# EasyEDA Pro project MN42_v2a.eprj, board MOAR_Board
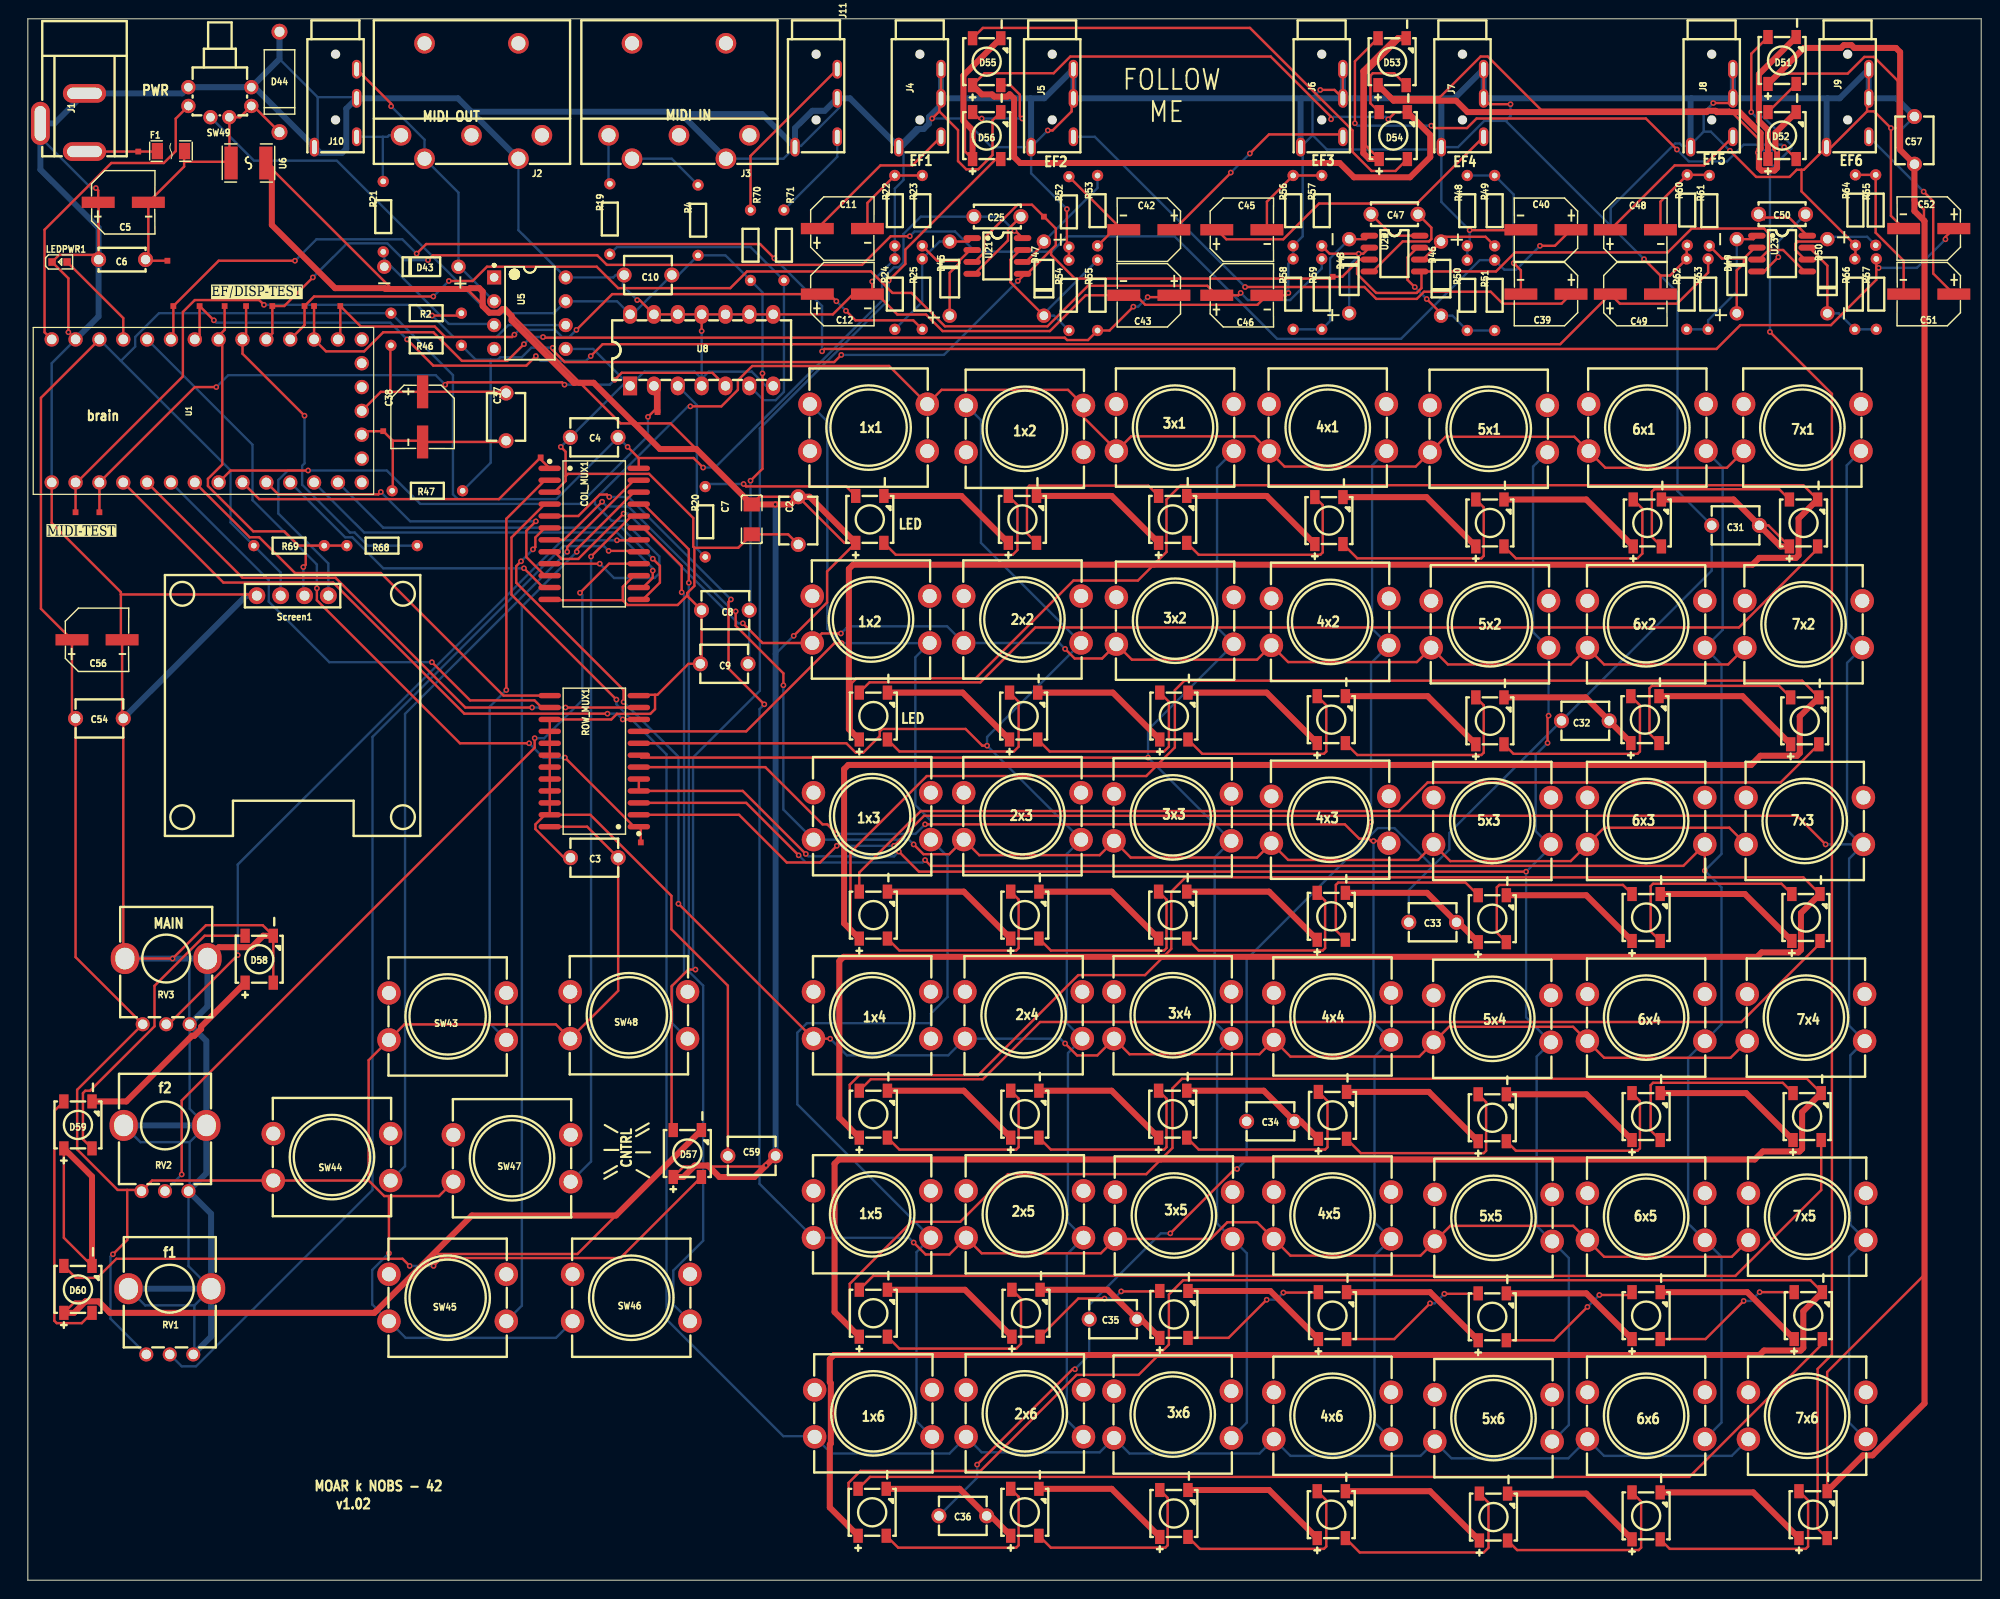
[diagram p3: board, top side]
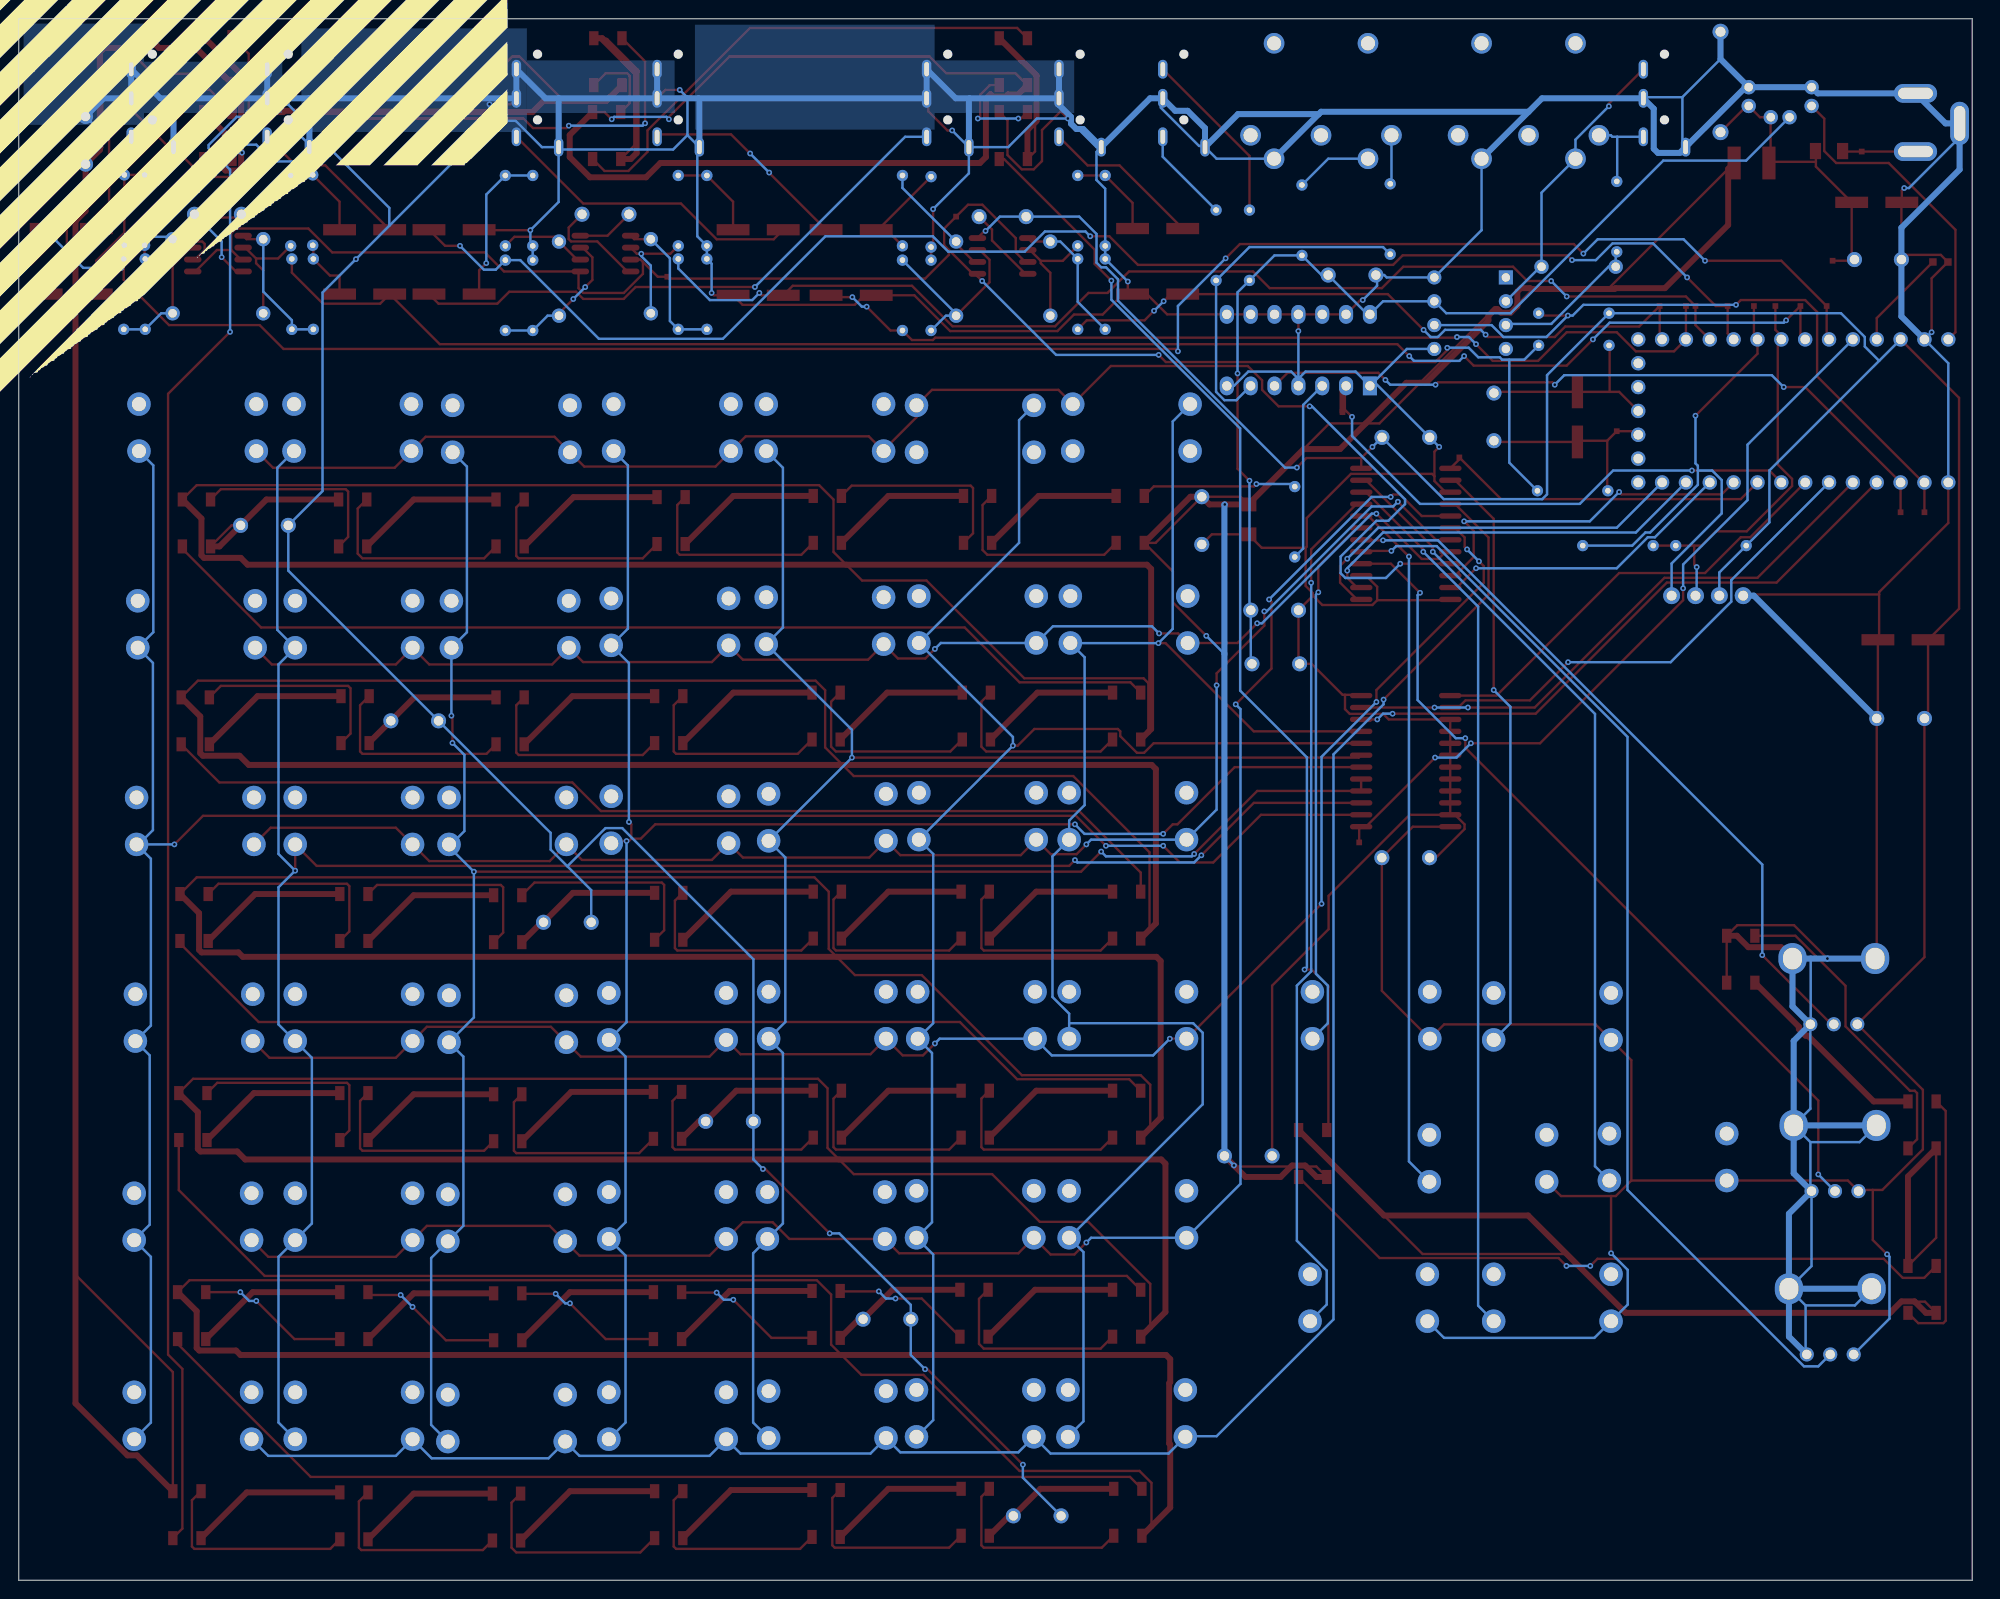
[diagram p4: board, bottom side, seen from below]

Outline 208.03 x 166.37 mm; copper layers: Top Layer, Bottom Layer. Coordinates in mm from the lower left corner of the outline.
Outline path: 0,166.37 0,0 208.03,0 208.03,166.37 0,166.37
Stack: Top Layer 0.035mm / Dielectric1 1.51mm FR4 er 4.5 / Bottom Layer 0.035mm

## Design rules (mm)
template: User Custom Config
spacing safeClearance (default): track to track 0.152, other pairs 0.152 to 0.3
track width trackWidth (default): min 0.127, default 0.254, max 2.54
differential pair differentialPair (default): width min 0.127, default 0.254, max 2.54; gap min 0.152, default 0.152
via viaSize (default): diameter min 0.5, default 0.61, max 10; hole min 0.3, default 0.305, max 5.999

## Placement (name value [footprint] x y rotation side)
C2  100nF  [CAP-TH_L5.0-W4.0-P5.00-D1.0]  82.04 112.9 270 top
C3  100nF  [CAP-TH_L5.0-W4.0-P5.00-D1.0]  60.33 76.98 0 top
C4  100nF  [CAP-TH_L5.0-W4.0-P5.00-D1.0]  60.31 121.77 0 top
C5  220uF  [CAP-SMD_BD6.3-L6.6-W6.6-FD]  10.16 146.81 0 top
C6  100nF  [CAP-TH_L5.0-W2.5-P5.00-D1.0]  10.03 140.72 0 top
C7  100uF  [C1206]  77.09 113.03 90 top
C8  1uF  [CAP-TH_L5.0-W4.0-P5.00-D1.0]  74.28 103.36 180 top
C9  100nF  [CAP-TH_L5.0-W4.0-P5.00-D1.0]  74.16 97.64 180 top
C10  100nF  [CAP-TH_L5.0-W4.0-P5.00-D1.0]  66.04 139.06 0 top
C11  1uF  [CAP-SMD_BD6.3-L6.6-W6.6-FD]  86.74 144.02 0 top
C12  1uF  [CAP-SMD_BD6.3-L6.6-W6.6-FD]  86.74 137.03 0 top
C25  100nF  [CAP-TH_L5.0-W2.5-P5.00-D1.0]  103.25 145.29 180 top
C31  100nF  [CAP-TH_L5.0-W4.0-P5.00-D1.0]  181.86 112.4 180 top
C32  100nF  [CAP-TH_L5.0-W4.0-P5.00-D1.0]  165.86 91.57 180 top
C33  100nF  [CAP-TH_L5.0-W4.0-P5.00-D1.0]  149.61 70.1 180 top
C34  100nF  [CAP-TH_L5.0-W4.0-P5.00-D1.0]  132.33 48.9 180 top
C35  100nF  [CAP-TH_L5.0-W4.0-P5.00-D1.0]  115.57 27.81 180 top
C36  100nF  [CAP-TH_L5.0-W4.0-P5.00-D1.0]  99.57 6.86 180 top
C37  100nF  [CAP-TH_L5.0-W4.0-P5.00-D1.0]  50.93 123.95 270 top
C38  4.7uF  [CAP-SMD_BD6.3-L6.6-W6.6-FD]  42.04 123.95 270 top
C39  1uF  [CAP-SMD_BD6.3-L6.6-W6.6-FD]  161.67 137.03 180 top
C40  1uF  [CAP-SMD_BD6.3-L6.6-W6.6-FD]  161.67 143.89 180 top
C42  1uF  [CAP-SMD_BD6.3-L6.6-W6.6-FD]  119.38 143.89 180 top
C43  1uF  [CAP-SMD_BD6.3-L6.6-W6.6-FD]  119.38 136.91 180 top
C45  1uF  [CAP-SMD_BD6.3-L6.6-W6.6-FD]  129.29 143.89 0 top
C46  1uF  [CAP-SMD_BD6.3-L6.6-W6.6-FD]  129.29 136.91 0 top
C47  100nF  [CAP-TH_L5.0-W2.5-P5.00-D1.0]  145.54 145.54 180 top
C48  1uF  [CAP-SMD_BD6.3-L6.6-W6.6-FD]  171.2 143.89 0 top
C49  1uF  [CAP-SMD_BD6.3-L6.6-W6.6-FD]  171.2 137.03 0 top
C50  100nF  [CAP-TH_L5.0-W2.5-P5.00-D1.0]  186.82 145.54 180 top
C51  1uF  [CAP-SMD_BD6.3-L6.6-W6.6-FD]  202.44 137.03 180 top
C52  1uF  [CAP-SMD_BD6.3-L6.6-W6.6-FD]  202.44 144.02 180 top
C54  1uF  [CAP-TH_L5.0-W4.0-P5.00-D1.0]  7.62 91.82 0 top
C56  10uF  [CAP-SMD_BD6.3-L6.6-W6.6-FD]  7.37 100.2 0 top
C57  100nF  [CAP-TH_L5.0-W4.0-P5.00-D1.0]  200.91 153.42 90 top
C59  100nF  [CAP-TH_L5.0-W4.0-P5.00-D1.0]  77.09 45.21 180 top
COL_MUX1  CD74HC4067M96  [SOIC-24_L15.4-W7.5-P1.27-LS10.3-BL]  60.31 111.48 270 top
D1  XL-5050RGBC-WS2812B  [LED-SMD_4P-L5.0-W5.0-BL_XL-5050RGBC]  89.66 113.03 0 top
D2  XL-5050RGBC-WS2812B  [LED-SMD_4P-L5.0-W5.0-BL_XL-5050RGBC]  105.92 113.03 0 top
D3  XL-5050RGBC-WS2812B  [LED-SMD_4P-L5.0-W5.0-BL_XL-5050RGBC]  121.92 113.03 0 top
D4  XL-5050RGBC-WS2812B  [LED-SMD_4P-L5.0-W5.0-BL_XL-5050RGBC]  138.56 112.9 0 top
D5  XL-5050RGBC-WS2812B  [LED-SMD_4P-L5.0-W5.0-BL_XL-5050RGBC]  155.7 112.65 0 top
D6  XL-5050RGBC-WS2812B  [LED-SMD_4P-L5.0-W5.0-BL_XL-5050RGBC]  172.47 112.65 0 top
D7  XL-5050RGBC-WS2812B  [LED-SMD_4P-L5.0-W5.0-BL_XL-5050RGBC]  189.1 112.65 0 top
D8  XL-5050RGBC-WS2812B  [LED-SMD_4P-L5.0-W5.0-BL_XL-5050RGBC]  90.04 92.08 0 top
D9  XL-5050RGBC-WS2812B  [LED-SMD_4P-L5.0-W5.0-BL_XL-5050RGBC]  106.05 92.08 0 top
D10  XL-5050RGBC-WS2812B  [LED-SMD_4P-L5.0-W5.0-BL_XL-5050RGBC]  122.05 92.08 0 top
D11  XL-5050RGBC-WS2812B  [LED-SMD_4P-L5.0-W5.0-BL_XL-5050RGBC]  138.81 91.69 0 top
D12  XL-5050RGBC-WS2812B  [LED-SMD_4P-L5.0-W5.0-BL_XL-5050RGBC]  155.7 91.57 0 top
D13  XL-5050RGBC-WS2812B  [LED-SMD_4P-L5.0-W5.0-BL_XL-5050RGBC]  172.21 91.69 0 top
D14  XL-5050RGBC-WS2812B  [LED-SMD_4P-L5.0-W5.0-BL_XL-5050RGBC]  189.23 91.57 0 top
D15  XL-5050RGBC-WS2812B  [LED-SMD_4P-L5.0-W5.0-BL_XL-5050RGBC]  90.04 70.87 0 top
D16  XL-5050RGBC-WS2812B  [LED-SMD_4P-L5.0-W5.0-BL_XL-5050RGBC]  106.17 70.87 0 top
D17  XL-5050RGBC-WS2812B  [LED-SMD_4P-L5.0-W5.0-BL_XL-5050RGBC]  121.92 70.87 0 top
D18  XL-5050RGBC-WS2812B  [LED-SMD_4P-L5.0-W5.0-BL_XL-5050RGBC]  138.81 70.74 0 top
D19  XL-5050RGBC-WS2812B  [LED-SMD_4P-L5.0-W5.0-BL_XL-5050RGBC]  155.96 70.49 0 top
D20  XL-5050RGBC-WS2812B  [LED-SMD_4P-L5.0-W5.0-BL_XL-5050RGBC]  172.34 70.61 0 top
D21  XL-5050RGBC-WS2812B  [LED-SMD_4P-L5.0-W5.0-BL_XL-5050RGBC]  189.36 70.61 0 top
D22  XL-5050RGBC-WS2812B  [LED-SMD_4P-L5.0-W5.0-BL_XL-5050RGBC]  90.04 49.66 0 top
D23  XL-5050RGBC-WS2812B  [LED-SMD_4P-L5.0-W5.0-BL_XL-5050RGBC]  106.17 49.66 0 top
D24  XL-5050RGBC-WS2812B  [LED-SMD_4P-L5.0-W5.0-BL_XL-5050RGBC]  121.92 49.66 0 top
D25  XL-5050RGBC-WS2812B  [LED-SMD_4P-L5.0-W5.0-BL_XL-5050RGBC]  138.94 49.53 0 top
D26  XL-5050RGBC-WS2812B  [LED-SMD_4P-L5.0-W5.0-BL_XL-5050RGBC]  155.96 49.28 0 top
D27  XL-5050RGBC-WS2812B  [LED-SMD_4P-L5.0-W5.0-BL_XL-5050RGBC]  172.34 49.4 0 top
D28  XL-5050RGBC-WS2812B  [LED-SMD_4P-L5.0-W5.0-BL_XL-5050RGBC]  189.48 49.4 0 top
D29  XL-5050RGBC-WS2812B  [LED-SMD_4P-L5.0-W5.0-BL_XL-5050RGBC]  90.04 28.45 0 top
D30  XL-5050RGBC-WS2812B  [LED-SMD_4P-L5.0-W5.0-BL_XL-5050RGBC]  106.3 28.45 0 top
D31  XL-5050RGBC-WS2812B  [LED-SMD_4P-L5.0-W5.0-BL_XL-5050RGBC]  122.05 28.32 0 top
D32  XL-5050RGBC-WS2812B  [LED-SMD_4P-L5.0-W5.0-BL_XL-5050RGBC]  138.94 28.19 0 top
D33  XL-5050RGBC-WS2812B  [LED-SMD_4P-L5.0-W5.0-BL_XL-5050RGBC]  155.96 28.07 0 top
D34  XL-5050RGBC-WS2812B  [LED-SMD_4P-L5.0-W5.0-BL_XL-5050RGBC]  172.34 28.19 0 top
D35  XL-5050RGBC-WS2812B  [LED-SMD_4P-L5.0-W5.0-BL_XL-5050RGBC]  189.61 28.19 0 top
D36  XL-5050RGBC-WS2812B  [LED-SMD_4P-L5.0-W5.0-BL_XL-5050RGBC]  89.92 7.24 0 top
D37  XL-5050RGBC-WS2812B  [LED-SMD_4P-L5.0-W5.0-BL_XL-5050RGBC]  106.17 7.24 0 top
D38  XL-5050RGBC-WS2812B  [LED-SMD_4P-L5.0-W5.0-BL_XL-5050RGBC]  122.05 7.11 0 top
D39  XL-5050RGBC-WS2812B  [LED-SMD_4P-L5.0-W5.0-BL_XL-5050RGBC]  138.81 6.99 0 top
D40  XL-5050RGBC-WS2812B  [LED-SMD_4P-L5.0-W5.0-BL_XL-5050RGBC]  156.08 6.73 0 top
D41  XL-5050RGBC-WS2812B  [LED-SMD_4P-L5.0-W5.0-BL_XL-5050RGBC]  172.34 6.86 0 top
D42  XL-5050RGBC-WS2812B  [LED-SMD_4P-L5.0-W5.0-BL_XL-5050RGBC]  190.12 6.99 0 top
D43  1N4148PF  [DO-35_BD1.9-L3.9-P7.90-D0.5-FD]  41.91 139.95 180 top
D44  SA6.0A  [DO-15_BD3.1-L6.7-P10.70-D0.8-RD]  26.8 159.64 90 top
D45  1N4148PF  [DO-35_BD1.9-L3.9-P7.90-D0.5-FD]  98.17 138.68 90 top
D46  1N4148PF  [DO-35_BD1.9-L3.9-P7.90-D0.5-FD]  150.5 138.68 270 top
D47  1N4148PF  [DO-35_BD1.9-L3.9-P7.90-D0.5-FD]  108.2 138.68 270 top
D48  1N4148PF  [DO-35_BD1.9-L3.9-P7.90-D0.5-FD]  140.72 138.94 90 top
D49  1N4148PF  [DO-35_BD1.9-L3.9-P7.90-D0.5-FD]  181.99 138.94 90 top
D50  1N4148PF  [DO-35_BD1.9-L3.9-P7.90-D0.5-FD]  191.64 138.94 270 top
D51  XL-5050RGBC-WS2812B  [LED-SMD_4P-L5.0-W5.0-BL_XL-5050RGBC]  186.82 161.93 0 top
D52  XL-5050RGBC-WS2812B  [LED-SMD_4P-L5.0-W5.0-BL_XL-5050RGBC]  186.82 153.92 0 top
D53  XL-5050RGBC-WS2812B  [LED-SMD_4P-L5.0-W5.0-BL_XL-5050RGBC]  145.29 161.8 0 top
D54  XL-5050RGBC-WS2812B  [LED-SMD_4P-L5.0-W5.0-BL_XL-5050RGBC]  145.42 153.92 0 top
D55  XL-5050RGBC-WS2812B  [LED-SMD_4P-L5.0-W5.0-BL_XL-5050RGBC]  102.11 161.8 0 top
D56  XL-5050RGBC-WS2812B  [LED-SMD_4P-L5.0-W5.0-BL_XL-5050RGBC]  102.11 153.92 0 top
D57  XL-5050RGBC-WS2812B  [LED-SMD_4P-L5.0-W5.0-BL_XL-5050RGBC]  70.23 45.47 0 top
D58  XL-5050RGBC-WS2812B  [LED-SMD_4P-L5.0-W5.0-BL_XL-5050RGBC]  24.64 66.17 0 top
D59  XL-5050RGBC-WS2812B  [LED-SMD_4P-L5.0-W5.0-BL_XL-5050RGBC]  5.33 48.51 0 top
D60  XL-5050RGBC-WS2812B  [LED-SMD_4P-L5.0-W5.0-BL_XL-5050RGBC]  5.33 30.99 0 top
F1  nSMD050-33V  [F1206]  15.24 152.27 0 top
J1  DC005  [DC-IN-TH_DC005]  3.68 155.32 270 top
J2  DIN-504B-M10  [CONN-TH_DIN-504B-M10]  47.24 157.61 180 top
J3  DIN-504B-M10  [CONN-TH_DIN-504B-M10]  69.34 157.61 180 top
J4  HC-PJ-320A  [AUDIO-SMD_HC-PJ-320A]  95 156.84 270 top
J5  HC-PJ-320A  [AUDIO-SMD_HC-PJ-320A]  109.09 156.84 270 top
J6  HC-PJ-320A  [AUDIO-SMD_HC-PJ-320A]  137.8 156.84 270 top
J7  HC-PJ-320A  [AUDIO-SMD_HC-PJ-320A]  152.78 156.84 270 top
J8  HC-PJ-320A  [AUDIO-SMD_HC-PJ-320A]  179.32 156.84 270 top
J9  HC-PJ-320A  [AUDIO-SMD_HC-PJ-320A]  193.8 156.84 270 top
J10  HC-PJ-320A  [AUDIO-SMD_HC-PJ-320A]  32.77 156.84 270 top
J11  HC-PJ-320A  [AUDIO-SMD_HC-PJ-320A]  83.95 156.84 270 top
LEDPWR1  -  [LED_0603]  3.43 140.46 0 top
NOREF  -  [Pad_e234]  54.61 119.63 0 top
NOREF#2  -  [Pad_e6035]  20.95 135.76 0 top
NOREF#3  -  [Pad_e6023]  33.27 135.76 0 top
NOREF#4  -  [Pad_e6020]  26.03 135.76 0 top
NOREF#5  -  [Pad_e236]  65.28 78.61 0 top
NOREF#6  -  [Pad_e6029]  15.49 135.76 0 top
NOREF#7  -  [Pad_e213]  14.86 140.59 0 top
NOREF#8  -  [Pad_e6036]  23.24 135.76 0 top
NOREF#9  -  [Pad_e6019]  18.29 135.76 0 top
NOREF#10  -  [Pad_e146]  11.76 152.22 0 top
NOREF#11  -  [Pad_e215]  37.85 122.43 0 top
NOREF#12  -  [Pad_e6017]  67.06 124.46 0 top
NOREF#13  -  [Pad_e223]  138.96 138.88 0 top
NOREF#14  -  [Pad_e222]  108.2 145.29 0 top
NOREF#15  -  [Pad_e6022]  30.48 135.76 0 top
NOREF#16  -  [Pad_e229]  184.7 145.19 0 top
NOREF#17  -  [Pad_e6015]  7.62 113.79 0 top
NOREF#18  -  [Pad_e6013]  5.08 113.79 0 top
NOREF#19  -  [Pad_e6021]  29.46 135.76 0 top
R2  4.7kΩ  [RES-TH_BD1.7-L3.5-P7.50-D0.5]  42.42 135 0 top
R4  220Ω  [RES-TH_BD1.7-L3.5-P7.50-D0.5]  71.37 144.91 270 top
R19  220Ω  [RES-TH_BD1.7-L3.5-P7.50-D0.5]  61.98 145.03 270 top
R20  33Ω  [RES-TH_BD1.7-L3.5-P7.50-D0.5]  72.14 112.78 90 top
R21  220Ω  [RES-TH_BD1.7-L3.5-P7.50-D0.5]  37.85 145.29 90 top
R22  100kΩ  [RES-TH_BD1.7-L3.5-P7.50-D0.5]  92.33 145.92 90 top
R23  10kΩ  [RES-TH_BD1.7-L3.5-P7.50-D0.5]  95.25 145.92 90 top
R24  20kΩ  [RES-TH_BD1.7-L3.5-P7.50-D0.5]  92.33 137.03 90 top
R25  4.7kΩ  [RES-TH_BD1.7-L3.5-P7.50-D0.5]  95.25 137.03 270 top
R46  100kΩ  [RES-TH_BD1.7-L3.5-P7.50-D0.5]  42.42 131.57 0 top
R47  100kΩ  [RES-TH_BD1.7-L3.5-P7.50-D0.5]  42.55 116.08 0 top
R48  100kΩ  [RES-TH_BD1.7-L3.5-P7.50-D0.5]  153.29 145.92 90 top
R49  10kΩ  [RES-TH_BD1.7-L3.5-P7.50-D0.5]  156.21 145.92 90 top
R50  20kΩ  [RES-TH_BD1.7-L3.5-P7.50-D0.5]  153.29 136.91 90 top
R51  4.7kΩ  [RES-TH_BD1.7-L3.5-P7.50-D0.5]  156.21 136.91 90 top
R52  100kΩ  [RES-TH_BD1.7-L3.5-P7.50-D0.5]  110.87 145.8 90 top
R53  10kΩ  [RES-TH_BD1.7-L3.5-P7.50-D0.5]  113.92 145.92 270 top
R54  20kΩ  [RES-TH_BD1.7-L3.5-P7.50-D0.5]  110.87 136.91 90 top
R55  4.7kΩ  [RES-TH_BD1.7-L3.5-P7.50-D0.5]  113.92 136.91 270 top
R56  100kΩ  [RES-TH_BD1.7-L3.5-P7.50-D0.5]  134.75 145.92 90 top
R57  10kΩ  [RES-TH_BD1.7-L3.5-P7.50-D0.5]  137.8 145.92 90 top
R58  20kΩ  [RES-TH_BD1.7-L3.5-P7.50-D0.5]  134.75 137.03 90 top
R59  4.7kΩ  [RES-TH_BD1.7-L3.5-P7.50-D0.5]  137.8 137.03 90 top
R60  100kΩ  [RES-TH_BD1.7-L3.5-P7.50-D0.5]  176.72 145.99 90 top
R61  10kΩ  [RES-TH_BD1.7-L3.5-P7.50-D0.5]  179.07 145.92 90 top
R62  20kΩ  [RES-TH_BD1.7-L3.5-P7.50-D0.5]  176.66 137.03 90 top
R63  4.7kΩ  [RES-TH_BD1.7-L3.5-P7.50-D0.5]  178.94 137.03 90 top
R64  100kΩ  [RES-TH_BD1.7-L3.5-P7.50-D0.5]  194.63 145.99 90 top
R65  10kΩ  [RES-TH_BD1.7-L3.5-P7.50-D0.5]  196.79 145.99 90 top
R66  20kΩ  [RES-TH_BD1.7-L3.5-P7.50-D0.5]  194.56 137.03 90 top
R67  4.7kΩ  [RES-TH_BD1.7-L3.5-P7.50-D0.5]  196.85 137.03 90 top
R68  4.7kΩ  [RES-TH_BD1.7-L3.5-P7.50-D0.5]  37.72 110.24 0 top
R69  4.7kΩ  [RES-TH_BD1.7-L3.5-P7.50-D0.5]  27.81 110.24 0 top
R70  220Ω  [RES-TH_BD1.7-L3.5-P7.50-D0.5]  76.96 142.24 270 top
R71  220Ω  [RES-TH_BD1.7-L3.5-P7.50-D0.5]  80.52 142.24 270 top
ROW_MUX1  CD74HC4067M96  [SOIC-24_L15.4-W7.5-P1.27-LS10.3-BL]  60.33 87.27 90 top
RV1  10kΩ  [RES-ADJ-TH_RK09K1130A5R]  15.11 27.56 0 top
RV2  10kΩ  [RES-ADJ-TH_RK09K1130A5R]  14.61 44.96 0 top
RV3  10kΩ  [RES-ADJ-TH_RK09K1130A5R]  14.73 62.74 0 top
Screen1  HS96L03W2C03  [OLED-TH_L27.8-W27.2-P2.54_C9900033791]  28.19 104.9 0 top
SW1  HX B3F-4055-Y  [SW-TH_4P-L12.0-W12.0-P5.00-LS12.5]  89.54 122.81 0 top
SW2  HX B3F-4055-Y  [SW-TH_4P-L12.0-W12.0-P5.00-LS12.5]  106.17 122.68 0 top
SW3  HX B3F-4055-Y  [SW-TH_4P-L12.0-W12.0-P5.00-LS12.5]  122.17 122.81 180 top
SW4  HX B3F-4055-Y  [SW-TH_4P-L12.0-W12.0-P5.00-LS12.5]  138.43 122.81 180 top
SW5  HX B3F-4055-Y  [SW-TH_4P-L12.0-W12.0-P5.00-LS12.5]  155.57 122.68 180 top
SW6  HX B3F-4055-Y  [SW-TH_4P-L12.0-W12.0-P5.00-LS12.5]  172.47 122.81 180 top
SW7  HX B3F-4055-Y  [SW-TH_4P-L12.0-W12.0-P5.00-LS12.5]  188.98 122.81 180 top
SW8  HX B3F-4055-Y  [SW-TH_4P-L12.0-W12.0-P5.00-LS12.5]  89.79 102.36 180 top
SW9  HX B3F-4055-Y  [SW-TH_4P-L12.0-W12.0-P5.00-LS12.5]  105.92 102.36 180 top
SW10  HX B3F-4055-Y  [SW-TH_4P-L12.0-W12.0-P5.00-LS12.5]  122.17 102.24 180 top
SW11  HX B3F-4055-Y  [SW-TH_4P-L12.0-W12.0-P5.00-LS12.5]  138.68 102.11 180 top
SW12  HX B3F-4055-Y  [SW-TH_4P-L12.0-W12.0-P5.00-LS12.5]  155.7 101.85 180 top
SW13  HX B3F-4055-Y  [SW-TH_4P-L12.0-W12.0-P5.00-LS12.5]  172.34 101.85 180 top
SW14  HX B3F-4055-Y  [SW-TH_4P-L12.0-W12.0-P5.00-LS12.5]  189.1 101.85 180 top
SW15  HX B3F-4055-Y  [SW-TH_4P-L12.0-W12.0-P5.00-LS12.5]  89.92 81.41 180 top
SW16  HX B3F-4055-Y  [SW-TH_4P-L12.0-W12.0-P5.00-LS12.5]  105.92 81.41 180 top
SW17  HX B3F-4055-Y  [SW-TH_4P-L12.0-W12.0-P5.00-LS12.5]  121.92 81.28 180 top
SW18  HX B3F-4055-Y  [SW-TH_4P-L12.0-W12.0-P5.00-LS12.5]  138.68 81.03 180 top
SW19  HX B3F-4055-Y  [SW-TH_4P-L12.0-W12.0-P5.00-LS12.5]  155.96 80.9 180 top
SW20  HX B3F-4055-Y  [SW-TH_4P-L12.0-W12.0-P5.00-LS12.5]  172.34 80.9 180 top
SW21  HX B3F-4055-Y  [SW-TH_4P-L12.0-W12.0-P5.00-LS12.5]  189.23 80.9 180 top
SW22  HX B3F-4055-Y  [SW-TH_4P-L12.0-W12.0-P5.00-LS12.5]  89.92 60.2 180 top
SW23  HX B3F-4055-Y  [SW-TH_4P-L12.0-W12.0-P5.00-LS12.5]  106.05 60.2 180 top
SW24  HX B3F-4055-Y  [SW-TH_4P-L12.0-W12.0-P5.00-LS12.5]  121.92 60.2 180 top
SW25  HX B3F-4055-Y  [SW-TH_4P-L12.0-W12.0-P5.00-LS12.5]  138.94 60.07 180 top
SW26  HX B3F-4055-Y  [SW-TH_4P-L12.0-W12.0-P5.00-LS12.5]  155.96 59.82 180 top
SW27  HX B3F-4055-Y  [SW-TH_4P-L12.0-W12.0-P5.00-LS12.5]  172.34 59.94 180 top
SW28  HX B3F-4055-Y  [SW-TH_4P-L12.0-W12.0-P5.00-LS12.5]  189.36 59.94 180 top
SW29  HX B3F-4055-Y  [SW-TH_4P-L12.0-W12.0-P5.00-LS12.5]  89.92 38.99 180 top
SW30  HX B3F-4055-Y  [SW-TH_4P-L12.0-W12.0-P5.00-LS12.5]  106.17 38.99 180 top
SW31  HX B3F-4055-Y  [SW-TH_4P-L12.0-W12.0-P5.00-LS12.5]  122.05 38.86 180 top
SW32  HX B3F-4055-Y  [SW-TH_4P-L12.0-W12.0-P5.00-LS12.5]  138.94 38.86 180 top
SW33  HX B3F-4055-Y  [SW-TH_4P-L12.0-W12.0-P5.00-LS12.5]  156.08 38.61 180 top
SW34  HX B3F-4055-Y  [SW-TH_4P-L12.0-W12.0-P5.00-LS12.5]  172.34 38.74 180 top
SW35  HX B3F-4055-Y  [SW-TH_4P-L12.0-W12.0-P5.00-LS12.5]  189.48 38.74 180 top
SW36  HX B3F-4055-Y  [SW-TH_4P-L12.0-W12.0-P5.00-LS12.5]  90.04 17.78 180 top
SW37  HX B3F-4055-Y  [SW-TH_4P-L12.0-W12.0-P5.00-LS12.5]  106.17 17.78 180 top
SW38  HX B3F-4055-Y  [SW-TH_4P-L12.0-W12.0-P5.00-LS12.5]  121.92 17.65 180 top
SW39  HX B3F-4055-Y  [SW-TH_4P-L12.0-W12.0-P5.00-LS12.5]  138.94 17.53 180 top
SW40  HX B3F-4055-Y  [SW-TH_4P-L12.0-W12.0-P5.00-LS12.5]  156.08 17.27 180 top
SW41  HX B3F-4055-Y  [SW-TH_4P-L12.0-W12.0-P5.00-LS12.5]  172.34 17.53 180 top
SW42  HX B3F-4055-Y  [SW-TH_4P-L12.0-W12.0-P5.00-LS12.5]  189.48 17.53 180 top
SW43  HX B3F-4055-Y  [SW-TH_4P-L12.0-W12.0-P5.00-LS12.5]  44.7 60.07 180 top
SW44  HX B3F-4055-Y  [SW-TH_4P-L12.0-W12.0-P5.00-LS12.5]  32.39 45.09 180 top
SW45  HX B3F-4055-Y  [SW-TH_4P-L12.0-W12.0-P5.00-LS12.5]  44.7 30.1 180 top
SW46  HX B3F-4055-Y  [SW-TH_4P-L12.0-W12.0-P5.00-LS12.5]  64.26 30.1 180 top
SW47  HX B3F-4055-Y  [SW-TH_4P-L12.0-W12.0-P5.00-LS12.5]  51.56 44.96 180 top
SW48  HX B3F-4055-Y  [SW-TH_4P-L12.0-W12.0-P5.00-LS12.5]  64.01 60.2 180 top
SW49  TK-6580A-1  [SW-TH_TK-6580A-1]  20.45 157.48 180 top
U1  Teensy  [teensy 4.0:MODULE_DEV-15583]  19.05 124.59 90 top
U5  6N138  [DIP-8_L9.8-W6.6-P2.54-LS7.6-BL]  53.47 135 270 top
U6  1812L200/33GR  [F1812]  23.5 151 0 top
U8  SN74AHCT125N  [PDIP-14_L19.3-W6.4-P2.54-LS7.6-BL]  71.75 131.06 0 top
U21  MCP6002DRG  [SOP-8_L4.9-W3.9-P1.27-LS6.0-BL]  103.25 141.1 270 top
U22  MCP6002DRG  [SOP-8_L4.9-W3.9-P1.27-LS6.0-BL]  145.54 141.35 270 top
U23  MCP6002DRG  [SOP-8_L4.9-W3.9-P1.27-LS6.0-BL]  186.82 141.35 270 top

## Footprints (pads in the part's own frame, mm; a bottom-side part is the same pattern mirrored in y, then rotated)
AUDIO-SMD_HC-PJ-320A
  oval 2x1 hole 1.5x0.5: 1(4.15,-2.25) 2(-4.15,2.25) 3(-1.05,2.25) 4(3.05,2.25)
C1206
  rect 1.485x1.728 smd: 1(-1.593,0) 2(1.593,0)
CAP-SMD_BD6.3-L6.6-W6.6-FD
  rect 3.5x1.2 smd: 1(-2.67,0) 2(2.67,0)
CAP-TH_L5.0-W2.5-P5.00-D1.0
  round 1.6 hole 1: 1(-2.5,0) 2(2.5,0)
CAP-TH_L5.0-W4.0-P5.00-D1.0
  round 1.6 hole 1: 1(-2.54,0) 2(2.54,0)
CONN-TH_DIN-504B-M10
  round 2.2 hole 1.5: 1(-7.5,3.65) 2(-5,6.15) 3(0,3.65) 4(5,6.15) 5(7.5,3.65) 6(-5,-6.15) 7(5,-6.15)
DC-IN-TH_DC005
  oval 2x4.6 hole 1.2x3.7: 1(3.1,2.35) 2(-3.1,2.35)
  oval 4.6x2 hole 3.7x1.2: 3(0.1,-2.35)
DIP-8_L9.8-W6.6-P2.54-LS7.6-BL
  rect 1.5x1.5 hole 0.9: 1(-3.81,-3.81)
  round 1.5 hole 0.9: 2(-1.27,-3.81) 3(1.27,-3.81) 4(3.81,-3.81) 5(3.81,3.81) 6(1.27,3.81) 7(-1.27,3.81) 8(-3.81,3.81)
DO-15_BD3.1-L6.7-P10.70-D0.8-RD
  round 1.7 hole 1.06: 1(-5.35,0) 2(5.35,0)
DO-35_BD1.9-L3.9-P7.90-D0.5-FD
  round 1.524 hole 0.914: 1(-3.95,0) 2(3.95,0)
F1206
  rect 1.19x1.728 smd: 1(-1.445,0) 2(1.445,0)
F1812
  rect 1.407x3.499 smd: 1(-1.853,0) 2(1.853,0)
LED-SMD_4P-L5.0-W5.0-BL_XL-5050RGBC
  rect 1x1.5 smd: 1(-1.5,-2.5) 2(1.5,-2.5) 3(1.5,2.5) 4(-1.5,2.5)
LED_0603
  rect 0.8x0.8 smd: 1(-0.851,-0.01) 2(0.75,-0.005)
OLED-TH_L27.8-W27.2-P2.54_C9900033791
  round 1.8 hole 1.05: 1(-3.81,0) 2(-1.27,0) 3(1.27,0) 4(3.81,0)
Pad_e146
  rect 0.61x0.61 smd: TP2(0,0)
Pad_e213
  rect 0.61x0.61 smd: TP3(0,0)
Pad_e215
  rect 0.61x0.61 smd: TP4(0,0)
Pad_e222
  rect 0.61x0.61 smd: TP5(0,0)
Pad_e223
  rect 0.61x0.61 smd: TP6(0,0)
Pad_e229
  rect 0.61x0.61 smd: TP7(0,0)
Pad_e234
  rect 0.61x0.61 smd: TP8(0,0)
Pad_e236
  rect 0.61x0.61 smd: TP9(0,0)
Pad_e6013
  rect 0.61x0.61 smd: TP10(0,0)
Pad_e6015
  rect 0.61x0.61 smd: TP11(0,0)
Pad_e6017
  rect 0.61x0.61 smd: TP12(0,0)
Pad_e6019
  rect 0.61x0.61 smd: TP13(0,0)
Pad_e6020
  rect 0.61x0.61 smd: TP14(0,0)
Pad_e6021
  rect 0.61x0.61 smd: TP15(0,0)
Pad_e6022
  rect 0.61x0.61 smd: TP16(0,0)
Pad_e6023
  rect 0.61x0.61 smd: TP17(0,0)
Pad_e6029
  rect 0.61x0.61 smd: TP18(0,0)
Pad_e6035
  rect 0.61x0.61 smd: TP19(0,0)
Pad_e6036
  rect 0.61x0.61 smd: TP20(0,0)
PDIP-14_L19.3-W6.4-P2.54-LS7.6-BL
  rect 1.5x2 hole 1: 1(-7.62,-3.81)
  oval 1.5x2 hole 1: 2(-5.08,-3.81) 3(-2.54,-3.81) 4(0,-3.81) 5(2.54,-3.81) 6(5.08,-3.81) 7(7.62,-3.81) 8(7.62,3.81) 9(5.08,3.81) 10(2.54,3.81) 11(0,3.81) 12(-2.54,3.81) 13(-5.08,3.81) 14(-7.62,3.81)
RES-ADJ-TH_RK09K1130A5R
  round 1.5 hole 1: 1(-2.5,-3.5) 2(0,-3.5) 3(2.5,-3.5)
  oval 3x3.3 hole 2x2.3: 4(4.4,3.5) 5(-4.4,3.5)
RES-TH_BD1.7-L3.5-P7.50-D0.5
  round 1.2 hole 0.6: 1(-3.75,0) 2(3.75,0)
SOIC-24_L15.4-W7.5-P1.27-LS10.3-BL
  oval 0.574x2.388 smd: 1(-6.985,-4.744) 2(-5.715,-4.744) 3(-4.445,-4.744) 4(-3.175,-4.744) 5(-1.905,-4.744) 6(-0.635,-4.744) 7(0.635,-4.744) 8(1.905,-4.744) 9(3.175,-4.744) 10(4.445,-4.744) 11(5.715,-4.744) 12(6.985,-4.744) 13(6.985,4.744) 14(5.715,4.744) 15(4.445,4.744) 16(3.175,4.744) 17(1.905,4.744) 18(0.635,4.744) 19(-0.635,4.744) 20(-1.905,4.744) 21(-3.175,4.744) 22(-4.445,4.744) 23(-5.715,4.744) 24(-6.985,4.744)
SOP-8_L4.9-W3.9-P1.27-LS6.0-BL
  oval 0.63x1.865 smd: 1(-1.905,-2.683) 2(-0.635,-2.683) 3(0.635,-2.683) 4(1.905,-2.683) 5(1.905,2.683) 6(0.635,2.683) 7(-0.635,2.683) 8(-1.905,2.683)
SW-TH_4P-L12.0-W12.0-P5.00-LS12.5
  round 2.5 hole 1.5: 1(-6.25,2.5) 2(6.25,2.5) 3(-6.25,-2.5) 4(6.25,-2.5)
SW-TH_TK-6580A-1
  round 1.524 hole 0.914: 1(3.35,-1.6) 2(3.35,0.4) 3(-3.35,-1.6) 4(-3.35,0.4) 5(1,1.6) 6(-1,1.6)
teensy 4.0:MODULE_DEV-15583
  round 1.53 hole 1.02: 0(-7.62,13.97) 1(-7.62,11.43) 2(-7.62,8.89) 3(-7.62,6.35) 3.3V_1(-2.54,-16.51) 3.3V_2(7.62,11.43) 4(-7.62,3.81) 5(-7.62,1.27) 6(-7.62,-1.27) 7(-7.62,-3.81) 8(-7.62,-6.35) 9(-7.62,-8.89) 10(-7.62,-11.43) 11(-7.62,-13.97) 12(-7.62,-16.51) 13(7.62,-16.51) 14(7.62,-13.97) 15(7.62,-11.43) 16(7.62,-8.89) 17(7.62,-6.35) 18(7.62,-3.81) 19(7.62,-1.27) 20(7.62,1.27) 21(7.62,3.81) 22(7.62,6.35) 23(7.62,8.89) G1(-7.62,16.51) G2(0,-16.51) G3(7.62,13.97) ON-OFF(5.08,-16.51) PGM(2.54,-16.51) VBAT(-5.08,-16.51) VIN(7.62,16.51)

## Nets
As in the schematic, except:
VIN_FUSED: C5.2 C6.2 D44.1 F1.2 NOREF#7.TP3 SW49.4 SW49.6 U6.1
VIN_RAW: F1.1 J1.1 NOREF#10.TP2
E1: C12.1 NOREF#3.TP17 R25.2 U1.14
E2: C43.1 NOREF#15.TP16 R55.2 U1.15
E3: C46.1 NOREF#19.TP15 R59.2 U1.16
E4: C40.1 NOREF#4.TP14 R51.2 U1.17
E5: C49.1 NOREF#9.TP13 R63.2 U1.20
E6: C52.1 NOREF#6.TP18 R67.2 U1.21
LED: NOREF#12.TP12 U1.6 U8.2
MIDI_RX: NOREF#18.TP10 R2.2 U1.0 U5.6
MIDI_TX: NOREF#17.TP11 U1.1 U8.5
MRC: COL_MUX1.1 NOREF.TP8 U1.7
MRR: NOREF#5.TP9 ROW_MUX1.1 U1.22
SCL: NOREF#2.TP19 R68.1 R69.2 Screen1.3 U1.19
SDA: NOREF#8.TP20 R68.2 Screen1.4 U1.18
VREF: NOREF#13.TP6 NOREF#14.TP5 R46.2 R47.2 U21.3 U21.5 U22.3 U22.5 U23.3 U23.5
$1N66700: C37.2 C38.2 NOREF#11.TP4 R47.1 U1.3.3V_1
$2N10057: C50.2 NOREF#16.TP7 U23.8

Pads without a net: J2 1 3 6 7; J3 1 3 6 7; SW1 3 4; SW2 3 4; SW3 3 4; SW4 3 4; SW5 3 4; SW6 3 4; SW7 3 4; SW8 3 4; SW9 3 4; SW10 3 4; SW11 3 4; SW12 3 4; SW13 3 4; SW14 3 4; SW15 3 4; SW16 3 4; SW17 3 4; SW18 3 4; SW19 3 4; SW20 3 4; SW21 3 4; SW22 3 4; SW23 3 4; SW24 3 4; SW25 3 4; SW26 3 4; SW27 3 4; SW28 3 4; SW29 3 4; SW30 3 4; SW31 3 4; SW32 3 4; SW33 3 4; SW34 3 4; SW35 3 4; SW36 3 4; SW37 3 4; SW38 3 4; SW39 3 4; SW40 3 4; SW41 3 4; SW42 3 4; SW43 3 4; SW44 3 4; SW45 3 4; SW46 3 4; SW47 3 4; SW48 3 4; U1 12 13 ON-OFF PGM VBAT; U5 1 4

## Via types
v1: diameter 0.61, hole 0.305, Top Layer to Bottom Layer, 171 vias

## Routing (per net, layer and track width the routed paths; a pad name or vN(x,y) marks a point on that pad's centre or on a via; arc(x,y) is an arc through that point)
3VDC: length 432.2
  Top Layer w0.254: U1.3.3V_2 1.39,125.98 1.39,103.51 C56.1 4.7,92.21 C54.1 5.08,66.39 RV3.1 5.25,52.25 5.25,45.9 9.57,41.59 10.58,41.59 ; 65.06,119.57 70.9,119.57 v1(71.92,118.55) ; 65.06,119.57 v1(63.87,120.76) ; 65.06,119.57 COL_MUX1.24 ; 36.3,42.59 37.95,40.93 38.45,40.93 ; 36.3,42.59 SW44.2 13.23,42.59 RV2.1 11.98,41.59 10.58,41.59 ; 36.3,42.59 36.3,55.41 SW43.2 40.11,59.22 56.23,59.22 SW48.2 62.87,62.81 C3.2 59.56,80.29 ROW_MUX1.24 ; 10.58,41.59 10.58,36.25 v1(9.06,34.73) ; 38.45,40.93 v1(38.45,34.84) ; 38.45,40.93 43.79,40.93 SW47.2 ; U21.8 105.17,143.76 v1(105.07,143.76)
  Bottom Layer w0.254: v1(71.92,118.55) 73.19,118.55 90.96,136.33 90.96,138.62 92.23,139.89 92.74,139.89 93.25,140.4 93.25,143.44 95.1,145.29 C25.2 103.55,145.29 v1(105.07,143.76) ; v1(9.06,34.73) 8.8,34.47 8.8,27.87 RV1.1 ; Screen1.2 26.92,107.38 R69.1 21.59,112.71 21.59,118.24 9.91,129.92 ; SW46.2 56.23,25.82 40.23,25.82 SW45.2 36.68,29.38 36.68,33.06 v1(38.45,34.84) ; 9.91,129.92 U1.3.3V_2 ; 9.91,129.92 11.43,131.44 11.43,132.46 13.97,135 R2.1 45.27,128.4 45.27,115.7 45.78,115.19 56.27,115.19 C4.2 v1(63.87,120.76)
5VDC: length 113
  Top Layer w0.254: v1(78.23,128.58) 78.23,118.42 v1(76.96,117.15)
  Bottom Layer w0.254: SW49.5 24.07,151.26 32.89,151.26 49.15,135 56.01,135 U5.7 62.74,136.27 U8.14 64.39,134.87 C10.2 69.28,139.06 R4.2 74.3,141.16 R70.2 78.23,137.22 v1(78.23,128.58) ; C9.1 76.82,97.77 C8.1 76.96,103.5 v1(76.96,117.15)
GND: length 1399.7
  Top Layer w0.254: 89.92,137.54 v1(89.92,138.37) ; 89.92,137.54 92.6,134.86 95.65,134.86 97.41,133.1 108.84,133.1 112.65,136.91 C43.2 117.98,136.91 119,135.89 130.94,135.89 C46.2 133.99,136.91 v1(134.24,137.16) ; 89.92,137.54 C12.2 89.28,136.91 87.76,136.91 85.73,134.87 U8.8 U8.9 U8.10 U8.11 ; COL_MUX1.3 56.08,115.93 57.27,117.12 57.27,117.63 ; J8.2 J8.3 181.07,157.39 v1(179.49,157.39) ; 63.36,104.42 63.87,103.91 69.2,103.91 70.22,104.93 ; 63.36,104.42 63.36,105.85 64.55,107.04 COL_MUX1.15 ; 63.36,104.42 55.65,104.42 COL_MUX1.12 ; U8.11 v1(71.75,133.1) ; U8.11 U8.12 U8.13 65.15,136.4 v1(64.9,136.4) ; 70.22,104.93 70.22,104.88 C8.2 71.74,97.77 C9.2 70.35,97.64 67.04,94.34 66.79,94.34 ; 70.22,104.93 70.22,105.18 70.98,105.94 70.98,110.01 ; v1(153.54,143.84) 158.95,143.84 C40.2 ; 195.87,156.5 196.63,156.5 v1(198.41,154.73) 198.41,145.38 C52.2 ; 195.87,156.5 195.87,157.71 J9.3 J9.2 ; 195.87,156.5 192.06,152.69 J9.1 189.14,150.28 188.88,150.28 ; 9.91,105.03 9.91,105.28 2.54,112.65 U1.G1 ; 9.91,105.03 24.26,105.03 Screen1.1 ; 9.91,105.03 9.91,100.33 C56.2 10.04,91.95 C54.2 10.16,66.41 RV3.5 v1(15.41,66.24) 18.97,69.79 25.01,69.79 D58.3 D58.2 ; v1(108.62,154.47) 109.13,154.47 111.16,156.5 111.16,157.71 J5.3 J5.2 ; v1(181.26,152.31) 184.06,149.52 187.62,149.52 188.38,150.28 188.88,150.28 ; 70.98,110.01 70.86,110.12 70.86,113.17 66.16,117.88 57.52,117.88 57.27,117.63 ; 70.98,110.01 75.66,110.01 C7.1 80.97,111.44 C2.2 ; 57.27,117.63 57.27,120.25 v1(56.76,120.76) ; ROW_MUX1.23 ROW_MUX1.22 ROW_MUX1.21 ROW_MUX1.20 ROW_MUX1.19 ROW_MUX1.18 ROW_MUX1.17 ROW_MUX1.16 ROW_MUX1.15 62.13,91.72 62.73,92.31 66.28,92.31 66.79,92.82 66.79,94.34 ; ROW_MUX1.23 55.07,81.56 54.06,80.54 54.06,80.03 57.11,76.98 C3.1 ; ROW_MUX1.23 59.9,81.56 68.53,72.92 68.53,69.36 74.55,63.35 74.55,45.21 ; J7.2 J7.3 155.66,157.27 v1(157.9,157.27) ; J6.2 J6.3 139.15,158.79 v1(137.64,158.79) ; v1(101.09,12.32) 111.25,22.48 v1(111.51,22.48) ; 188.88,150.28 188.88,147.98 R64.1 194.63,140.85 R66.2 ; R60.1 176.66,142.17 R62.2 174.89,139.01 173.87,139.01 ; v1(121.67,36.96) 128.52,43.81 v1(128.78,43.81) ; 173.87,139.01 C49.2 ; 173.87,139.01 v1(172.12,140.76) ; v1(96.3,155.74) 97.06,156.5 ; 97.06,156.5 97.06,157.71 J4.3 J4.2 ; 97.06,156.5 99.06,154.51 99.06,151.21 99.94,150.33 101.21,150.33 102.73,151.85 102.73,155.55 D56.3 ; ROW_MUX1.12 65.15,94.34 66.79,94.34 ; v1(7.24,148.34) 7.49,148.08 C5.1 7.53,146.77 C6.1 7.04,141.21 3.34,141.21 LEDPWR1.1 4.32,138.71 v1(4.32,132.97) ; v1(110.65,146.09) 110.65,142.26 R52.1 R54.2
  Top Layer w0.635: RV3.4 20.34,67.45 23.83,67.45 25.05,68.67 D58.3
  Bottom Layer w0.254: 71.75,128.02 70.99,128.78 65.66,128.78 U8.1 63.63,127.76 ; 71.75,128.02 v1(71.75,133.1) ; 71.75,128.02 72.52,128.78 77.09,128.78 78.61,127.25 U8.7 ; 71.75,128.02 U8.4 ; v1(181.26,152.31) 179.23,154.35 178.47,154.35 ; v1(56.76,120.76) C4.1 63.63,127.63 63.63,127.76 ; 63.63,127.76 60.2,131.19 U5.5 ; v1(198.41,154.73) 199.69,154.73 C57.2 ; 136.81,153.97 136.81,157.97 v1(137.64,158.79) ; 136.81,153.97 138.34,152.44 150.28,152.44 J7.1 ; 136.81,153.97 J6.1 135.76,152.48 135.76,143.19 R56.1 R58.2 134.24,140.28 v1(134.24,137.16) ; v1(121.67,36.96) 120.65,36.96 113.03,29.34 C35.2 113.03,24 v1(111.51,22.48) ; 17.23,46.68 RV2.4 17.23,50.23 RV3.3 ; 17.23,46.68 11.98,46.68 RV2.5 ; 17.23,46.68 17.23,41.58 ; 149.61,76.07 151.38,77.85 151.38,79.63 C32.2 179.32,107.57 C31.2 175.68,116.04 175.68,137.2 v1(172.12,140.76) 168.56,144.31 ; 149.61,76.07 145.54,80.14 143.76,80.14 129.79,66.17 C34.2 129.79,44.83 v1(128.78,43.81) ; 149.61,76.07 147.07,73.53 C33.2 ; 63.37,139.06 62.61,139.06 62.36,138.81 U5.8 52.24,143.84 J2.2 ; 63.37,139.06 C10.1 ; 63.37,139.06 63.37,137.92 v1(64.9,136.4) ; 168.56,144.31 168.56,146.22 175.42,153.08 175.93,153.08 176.19,152.82 176.95,152.82 ; 168.56,144.31 157.39,155.49 ; C36.2 101.09,10.92 v1(101.09,12.32) ; J11.3 86.4,157.78 86.4,156.89 82.33,152.82 81.82,152.82 80.46,151.46 J3.2 ; U1.G1 2.54,129.67 U1.G3 v1(4.32,132.97) ; 176.95,152.82 178.47,154.35 ; 176.95,152.82 J8.1 ; 17.19,66.24 17.19,59.28 ; v1(7.24,148.34) 6.73,148.34 1.33,153.73 ; 95.97,155.41 v1(96.3,155.74) 99.6,155.74 102.65,152.69 J5.1 ; J5.1 v1(108.62,154.47) ; J5.1 106.84,149.9 v1(110.65,146.09) ; 178.47,154.35 178.47,156.38 v1(179.49,157.39) ; 17.73,29.28 12.49,29.28 RV1.5 ; 17.73,29.28 17.73,24.18 ; 17.73,29.28 19.51,31.06 17.11,33.47 RV2.3 ; 26.8,162.08 30.86,158.02 ; 30.86,158.02 30.86,153.04 J10.1 ; 30.86,158.02 34.89,158.02 J10.3 ; J7.1 152.31,152.69 155.1,155.49 157.39,155.49 ; J7.1 150.53,146.85 v1(153.54,143.84) 153.54,142.43 R48.1 R50.2 ; v1(89.92,138.37) R24.2 R22.1 92.33,148.27 93.25,149.19 93.25,152.19 J4.1 93.25,152.69 95.18,154.62 ; 157.39,155.49 157.9,156 v1(157.9,157.27)
  Bottom Layer w0.635: 69.59,156.21 78.18,156.21 81.7,152.69 81.7,154.72 83.55,156.56 84.87,156.56 J11.3 87.55,157.9 J4.1 94.68,154.62 95.4,154.62 95.97,155.19 95.97,155.92 97.25,157.19 J4.3 ; 69.59,156.21 69.34,156.46 47.24,156.46 ; 69.59,156.21 J3.2 ; Screen1.1 23.24,104.9 C54.2 ; J6.3 150.54,157.9 ; J6.3 J6.2 ; J6.3 135.65,157.9 ; 150.54,157.9 150.53,157.88 J7.1 ; 150.54,157.9 151.93,157.9 J7.2 J7.3 177.13,157.9 ; 135.65,157.9 J5.3 J5.2 108.24,157.9 106.79,157.9 ; 135.65,157.9 135.55,157.79 J6.1 ; RV2.4 19.01,57.47 RV3.3 19.13,61.14 RV3.4 v1(15.41,66.24) RV3.5 ; RV2.4 19.01,43.36 RV2.3 19.51,39.05 19.51,31.06 ; RV2.4 RV2.5 ; 106.79,157.9 106.84,157.84 J5.1 ; 106.79,157.9 J4.3 ; J8.3 J8.2 ; J8.3 177.13,157.9 ; J8.3 191.61,157.9 ; SW49.3 SW49.1 16.44,158.42 J1.2 2.83,155.22 1.33,155.22 1.33,150.31 7.53,144.11 C6.1 7.53,134.66 U1.G3 ; SW49.3 26.8,162.08 D44.2 ; SW49.3 24.13,159.08 J10.1 31.13,152.08 33.46,152.08 33.91,152.53 33.91,156.79 J10.3 45.81,157.9 47.24,156.46 ; 19.51,31.06 19.51,25.96 RV1.3 ; 19.51,31.06 RV1.5 ; 47.24,156.46 J2.2 ; J9.1 191.55,157.84 191.61,157.9 ; 191.61,157.9 192.95,157.9 J9.2 J9.3 198.98,157.9 C57.2 ; J4.3 J4.2 ; 177.13,157.9 177.07,157.84 J8.1
VIN_FUSED: length 32.5
  Top Layer w0.254: D44.1 24.01,157.08 SW49.4 22.6,155.88 SW49.6 21.47,155.86 21.47,151.13 ; 16.64,151.13 16.64,152.23 F1.2 ; 16.64,151.13 21.47,151.13 ; 16.64,151.13 16.64,150.62 C5.2 ; 21.47,151.13 U6.1 ; C6.2 12.66,140.59 12.83,140.59 ; 12.83,140.59 NOREF#7.TP3 ; 12.83,140.59 12.83,146.81
VIN_RAW: length 7.8
  Top Layer w0.254: F1.1 13.74,152.22 NOREF#10.TP2 J1.1
CNTRL_LED: length 167.6
  Top Layer w0.254: D51.4 183.54,162.65 v1(183.54,156.43) ; D42.2 190.6,5.5 190.6,22.52 192.13,24.04 192.13,126.41 v1(185.52,133.01)
  Bottom Layer w0.254: v1(185.52,133.01) 185.52,150.28 187.81,152.57 187.81,152.92 184.81,155.92 184.05,155.92 v1(183.54,156.43)
CNTRLLP: length 227.2
  Top Layer w0.254: 201.93,32.5 191.62,22.19 D42.3 ; 199.39,152.4 199.14,152.65 199.14,159.77 196.6,162.31 195.58,162.31 193.8,160.53 186.42,160.53 ; 200.91,147.05 201.93,146.03 201.93,144.87
  Top Layer w0.635: D42.3 195.44,13.31 196.45,13.31 201.99,18.85 201.99,144.81 200.91,145.89 C57.1 199.39,152.4 199.39,162.81 198.94,163.26 194.51,163.26 194.2,163.56 193.4,163.56 193.1,163.26 189.16,163.26 D51.1
COL1: length 164
  Top Layer w0.254: 115.98,120.36 112.42,123.91 SW2.2 110.77,126.83 97.31,126.83 SW1.2 91.72,129.37 77.14,129.37 75.62,127.85 75.62,126.83 73.86,125.07 v1(70.56,125.07) ; 115.98,120.36 117.5,121.88 130.61,121.88 SW4.2 133.83,118.66 147.8,118.66 SW5.2 150.98,121.83 164.69,121.83 SW6.2 167.99,118.53 180.95,118.53 SW7.2 ; 115.98,120.36 SW3.2 ; COL_MUX1.9 v1(60.9,108.31)
  Bottom Layer w0.254: v1(70.56,125.07) 70.3,125.07 60.39,115.17 60.39,114.66 62.17,112.88 63.44,112.88 67.25,109.07 67.25,107.29 66.75,106.79 62.43,106.79 v1(60.9,108.31)
COL2: length 143.7
  Top Layer w0.254: SW14.2 181.07,97.58 167.87,97.58 SW13.2 164.31,97.58 151.23,97.58 SW12.2 147.93,97.83 134.21,97.83 SW11.2 130.91,98.08 117.58,98.08 SW10.2 114.4,98.21 111.48,98.21 v1(110.46,99.23) ; v1(76.14,101.96) 78.24,99.86 SW8.2 84.55,100.88 v1(86.59,100.88) ; COL_MUX1.8 56.08,109.58 56.84,108.82 58.62,108.82 v1(63.44,113.64)
  Bottom Layer w0.254: v1(110.46,99.23) 109.83,99.86 SW9.2 97.89,101.64 87.35,101.64 v1(86.59,100.88) ; v1(63.44,113.64) 63.95,113.64 75.64,101.96 v1(76.14,101.96)
COL3: length 161.7
  Top Layer w0.254: v1(94.33,78.4) 95.38,77.36 98.12,77.36 SW16.2 101.32,77.26 114.15,77.26 SW17.2 117.45,77 130.91,77 SW18.2 134.21,76.75 148.06,76.75 SW19.2 151.48,76.62 164.31,76.62 SW20.2 167.87,80.18 181.2,80.18 SW21.2 ; v1(75.38,103.23) 75.38,101.71 80.46,96.63 v1(80.46,95.36) ; v1(61.16,114.91) 57.09,110.85 COL_MUX1.7
  Bottom Layer w0.254: v1(80.46,95.36) 80.46,82.11 SW15.2 93.83,78.91 v1(94.33,78.4) ; v1(75.38,103.23) 75.13,103.23 63.95,114.41 61.67,114.41 v1(61.16,114.91)
COL4: length 177.2
  Top Layer w0.254: v1(110.46,57.19) 111.73,55.92 113.89,55.92 SW24.2 117.32,56.05 131.16,56.05 SW25.2 134.47,55.79 148.18,55.79 SW26.2 151.36,58.97 164.56,58.97 SW27.2 167.87,55.67 181.33,55.67 SW28.2 ; v1(69.28,72.08) SW22.2 v1(85.44,57.7) ; v1(52.52,108.56) 52.01,108.06 52.01,106.28 63.44,94.85 v1(63.44,93.58) ; v1(53.79,109.83) 54.05,110.09 54.05,111.1 55.06,112.12 COL_MUX1.6
  Bottom Layer w0.254: v1(110.46,57.19) 109.95,57.7 SW23.2 98.02,55.92 87.22,55.92 v1(85.44,57.7) ; v1(53.79,109.83) v1(52.52,108.56) ; v1(63.44,93.58) 69.28,87.74 v1(69.28,72.08)
COL5: length 205.1
  Top Layer w0.254: v1(94.33,35.98) 95.6,34.71 98.14,34.71 SW30.2 101.57,34.84 114.27,34.84 SW31.2 125.96,36.36 127.73,38.14 130.91,38.14 SW32.2 134.47,34.58 148.31,34.58 SW33.2 151.48,37.76 164.56,37.76 SW34.2 167.87,34.46 181.46,34.46 SW35.2 ; v1(61.92,115.42) 61.67,115.68 60.9,115.68 58.62,113.39 COL_MUX1.5 ; v1(74.87,104.5) 74.62,104.25 74.62,97.13 v1(78.43,93.32)
  Bottom Layer w0.254: v1(78.43,93.32) 77.92,92.82 77.92,42.23 SW29.2 93.83,36.49 v1(94.33,35.98) ; v1(61.92,115.42) 63.95,115.42 v1(74.87,104.5)
COL6: length 224.6
  Top Layer w0.254: COL_MUX1.4 55.06,114.66 51.5,111.1 51.5,105.01 v1(62.68,93.83)
  Bottom Layer w0.254: SW42.2 181.46,13.25 167.87,13.25 SW41.2 164.06,12.99 151.61,12.99 SW40.2 148.31,13.25 134.47,13.25 SW39.2 131.16,13.5 117.32,13.5 SW38.2 114.15,13.63 101.57,13.63 SW37.2 98.14,13.5 85.57,13.5 SW36.2 83.73,15.35 80.46,15.35 68.02,27.79 68.02,87.99 62.68,93.32 v1(62.68,93.83)
CTRL1: length 63.3
  Top Layer w0.254: v1(50.95,94.85) 50.95,113.09 55.06,117.2 COL_MUX1.2
  Bottom Layer w0.254: v1(50.95,94.85) 49.18,93.07 49.18,59.35 SW43.1
CTRL2: length 85.9
  Top Layer w0.254: v1(57.44,109.58) 57.44,110.09 64.55,117.2 COL_MUX1.23
  Bottom Layer w0.254: SW44.1 40.17,44.12 40.17,92.31 v1(57.44,109.58)
CTRL3: length 94.5
  Top Layer w0.254: v1(58.45,109.58) 58.45,109.83 64.55,115.93 COL_MUX1.22
  Bottom Layer w0.254: SW45.1 52.61,29.26 52.61,103.74 v1(58.45,109.58)
CTRL4: length 92.3
  Top Layer w0.254: COL_MUX1.21 65.56,114.66 70.39,109.83 v1(70.39,106.28)
  Bottom Layer w0.254: v1(70.39,106.28) 70.39,64.88 71.92,63.35 71.92,36.17 68.73,32.99 68.73,29.38 SW46.1
CTRL5: length 74.4
  Top Layer w0.254: v1(59.98,109.07) 64.3,113.39 COL_MUX1.20
  Bottom Layer w0.254: v1(59.98,109.07) 59.98,44.62 SW47.1
CTRL6: length 57.9
  Top Layer w0.254: COL_MUX1.19 65.56,112.12 69.63,108.06 v1(69.63,105.26)
  Bottom Layer w0.254: SW48.1 68.61,59.34 68.61,63.35 69.88,64.62 69.88,105.01 v1(69.63,105.26)
E1: length 71.1
  Top Layer w0.254: v1(58.42,133.22) 62.23,137.03 C12.1 85.34,137.03 v1(86.1,136.27) ; v1(87.12,135.25) 88.14,134.24 94.29,134.24 R25.2 ; v1(51.82,132.72) 51.56,132.46 44.45,132.46 43.33,133.58 35.46,133.58 NOREF#3.TP17 33.27,132.46 U1.14
  Bottom Layer w0.254: v1(58.42,133.22) 57.66,132.46 56.9,132.46 56.13,133.22 52.32,133.22 v1(51.82,132.72) ; v1(86.1,136.27) v1(87.12,135.25)
E2: length 100.9
  Top Layer w0.254: v1(117.73,135.7) 115.19,133.16 R55.2 112.9,132.14 110.68,132.14 110.42,132.39 54.93,132.39 v1(54.86,132.46) ; v1(119.25,136.71) 121.86,136.71 C43.1 ; NOREF#15.TP16 U1.15 31.75,130.94 35.81,130.94 37.85,132.97 43.18,132.97 46.23,129.92 51.05,129.92 v1(52.83,131.7)
  Bottom Layer w0.254: v1(52.83,131.7) 53.59,132.46 v1(54.86,132.46) ; v1(119.25,136.71) 118.24,135.7 v1(117.73,135.7)
E3: length 123.4
  Top Layer w0.254: v1(43.18,136.78) 30.48,136.78 NOREF#19.TP15 29.46,133.73 U1.16 ; v1(129.16,137.16) 128.9,136.91 C46.1 125.6,137.92 112.9,137.92 108.58,133.6 97.66,133.6 94.11,137.16 92.08,137.16 89.79,139.45 76.58,139.45 74.8,137.67 62.87,137.67 60.58,139.95 48.89,139.95 47.37,138.43 v1(44.83,138.43)
  Bottom Layer w0.254: R59.2 137.8,139.77 134.43,136.4 129.92,136.4 v1(129.16,137.16) ; v1(43.18,136.78) v1(44.83,138.43)
E4: length 159.5
  Top Layer w0.254: v1(93.92,143.2) 91.89,143.2 88.84,140.15 61.66,140.15 60.65,141.16 43.12,141.16 v1(42.61,140.66) ; v1(30.35,138.81) 27.31,135.76 NOREF#4.TP14 26.03,132.84 U1.17 ; C40.1 162.63,142.18 v1(161.04,142.18)
  Bottom Layer w0.254: v1(30.35,138.81) 33.98,142.43 38.29,142.43 40.07,140.66 v1(42.61,140.66) ; v1(161.04,142.18) 158.5,139.64 157.23,139.64 R51.2 154.63,140.66 146.24,132.27 133.04,132.27 122.11,143.2 110.68,143.2 109.04,141.55 100.9,141.55 98.75,143.7 94.43,143.7 v1(93.92,143.2)
E5: length 173.9
  Top Layer w0.254: v1(54.1,130.43) 53.09,129.41 43.18,129.41 v1(40.39,132.21) ; R63.2 178.94,139.32 175.64,136.02 169.54,136.02 C49.1 163.19,131.7 61.21,131.7 v1(59.94,130.43) ; v1(19.81,134.24) NOREF#9.TP13 18.29,132.72 U1.20
  Bottom Layer w0.254: v1(40.39,132.21) 38.61,133.99 20.07,133.99 v1(19.81,134.24) ; v1(59.94,130.43) 59.44,129.92 54.61,129.92 v1(54.1,130.43)
E6: length 212.1
  Top Layer w0.254: v1(28.45,140.59) 20.32,140.59 NOREF#6.TP18 15.49,132.46 U1.21 ; v1(79.5,140.84) 77.98,142.37 42.42,142.37 v1(41.4,141.35) ; v1(84.58,130.94) 84.84,131.19 179.83,131.19 182.37,133.73 192.02,133.73 196.85,138.56 196.85,139.83 ; 196.85,139.83 R67.2 ; 196.85,139.83 v1(197.1,139.83) ; C52.1 204.22,143.13 v1(204.22,142.88)
  Bottom Layer w0.254: v1(41.4,141.35) 39.88,142.88 30.73,142.88 v1(28.45,140.59) ; v1(84.58,130.94) 84.58,135.76 v1(79.5,140.84) ; v1(204.22,142.88) 201.17,139.83 v1(197.1,139.83)
FP1: length 115.2
  Top Layer w0.254: v1(61.85,109.67) 64.96,109.67 COL_MUX1.17
  Bottom Layer w0.254: RV1.2 16.38,22.79 17.91,22.79 36.7,41.59 36.7,89.86 57.02,110.18 61.34,110.18 v1(61.85,109.67)
FP2: length 90.4
  Top Layer w0.254: v1(58.8,105.21) 61.9,108.31 COL_MUX1.16 ; v1(53.98,89.72) 53.98,88.7 16.38,51.11 v1(16.38,43.24)
  Bottom Layer w0.254: v1(58.8,105.21) 59.06,104.96 59.06,93.78 54.99,89.72 v1(53.98,89.72) ; RV2.2 v1(16.38,43.24)
LED: length 59.6
  Top Layer w0.254: v1(29.84,118.24) 21.59,118.24 U1.6 ; NOREF#12.TP12 66.8,124.71 ; 66.8,124.71 66.8,127.13 ; 66.8,124.71 v1(66.04,123.95)
  Top Layer w0.635: U8.2 67.06,126.87 NOREF#12.TP12
  Bottom Layer w0.254: v1(29.84,118.24) 38.23,118.24 41.78,114.68 58.8,114.68 66.04,121.92 v1(66.04,123.95)
LEDCNTRL: length 16.7
  Top Layer w0.254: v1(76.22,116.8) 76.48,116.55 87.15,116.55 D1.4
  Bottom Layer w0.254: R20.2 72.41,116.8 v1(76.22,116.8)
MAIN: length 77.4
  Top Layer w0.254: COL_MUX1.18 65.01,110.8 v1(62.74,110.8) ; v1(22.35,66.6) 14.99,59.24 RV3.2
  Bottom Layer w0.254: v1(62.74,110.8) 56.9,110.8 22.35,76.26 v1(22.35,66.6)
MIDI_OUT: length 36.9
  Bottom Layer w0.254: U8.6 78.36,125.73 79.63,125.73 80.52,126.62 R71.2 76.96,142.05 62.74,142.05 R19.2
MIDI_RX: length 72.9
  Top Layer w0.254: R2.2 45.91,134.75 v1(43.05,134.75) ; 5.08,116.84 U1.0 ; 5.08,116.84 16.51,128.27 16.51,135.13 17.78,136.4 24.64,136.4 v1(25.15,135.89) ; 5.08,116.84 NOREF#18.TP10
  Bottom Layer w0.254: v1(25.15,135.89) 41.4,135.89 42.55,134.75 v1(43.05,134.75) 45.34,132.46 49.91,132.46 51.18,133.73 U5.6
MIDI_TX: length 76.3
  Top Layer w0.254: NOREF#17.TP11 U1.1 17.78,127.13 v1(20.07,127.13) ; v1(57.15,127.38) 56.9,127.64 44.7,127.64 v1(44.45,127.38) ; v1(62.48,127.89) 63.25,128.65 72.9,128.65 U8.5
  Bottom Layer w0.254: v1(57.15,127.38) 61.98,127.38 v1(62.48,127.89) ; v1(44.45,127.38) 43.43,128.4 21.34,128.4 v1(20.07,127.13)
MRC: length 35.9
  Top Layer w0.254: U1.7 24.64,115.19 50.17,115.19 NOREF.TP8 54.61,119.43 COL_MUX1.1
MRR: length 81.3
  Top Layer w0.254: NOREF#5.TP9 65.28,80.08 ROW_MUX1.1 64.56,80.29 v1(57.2,87.65) ; v1(30.78,105.69) 30.78,104.42 46.02,89.18 v1(53.39,89.18)
  Bottom Layer w0.254: U1.22 23.92,120.99 23.92,115.08 30.78,108.23 v1(30.78,105.69) ; v1(53.39,89.18) 54.91,87.65 v1(57.2,87.65)
MUXC1: length 38.2
  Top Layer w0.254: v1(54.1,112.82) 53.09,111.81 53.09,109.01 55.06,107.04 COL_MUX1.10 ; U1.8 26.67,115.7 37.34,115.7 v1(37.59,115.95)
  Bottom Layer w0.254: v1(37.59,115.95) 40.72,112.82 v1(54.1,112.82)
MUXC2: length 32.3
  Top Layer w0.254: COL_MUX1.11 54.89,105.77 v1(52.83,107.82)
  Bottom Layer w0.254: v1(52.83,107.82) 37.85,107.82 34.54,111.12 33.78,111.12 U1.9
MUXC3: length 42.8
  Top Layer w0.254: v1(66.55,107.57) 66.55,106.81 65.53,105.79 65.08,105.79 COL_MUX1.14
  Bottom Layer w0.254: U1.10 35.81,111.63 62.74,111.63 66.55,107.82 v1(66.55,107.57)
MUXC4: length 42.7
  Top Layer w0.254: COL_MUX1.13 65.51,104.5 67.31,106.3 67.31,108.08 v1(66.55,108.84)
  Bottom Layer w0.254: U1.11 37.85,112.14 63.25,112.14 v1(66.55,108.84)
MUXR1: length 65.4
  Top Layer w0.254: v1(63.35,91.72) ROW_MUX1.10 ; U1.2 20.83,106.3 32.51,106.3 46.48,92.33 v1(61.72,92.33)
  Bottom Layer w0.254: v1(63.35,91.72) 62.74,92.33 v1(61.72,92.33)
MUXR2: length 62.3
  Top Layer w0.254: v1(53.7,92.99) 46.59,92.99 32.77,106.81 22.86,106.81 U1.3 ; v1(57.26,92.99) ROW_MUX1.11
  Bottom Layer w0.254: v1(53.7,92.99) v1(57.26,92.99)
MUXR3: length 51.6
  Top Layer w0.254: v1(43.03,97.81) 47.1,93.75 53.95,93.75 54.72,92.99 ROW_MUX1.14
  Bottom Layer w0.254: U1.4 25.65,106.55 25.65,104.27 32.11,97.81 v1(43.03,97.81)
MUXR4: length 47.2
  Top Layer w0.254: U1.5 23.62,111.12 24.64,111.12 28.45,107.32 37.59,107.32 50.65,94.26 ROW_MUX1.13
ROW1: length 171.6
  Top Layer w0.254: ROW_MUX1.9 76.5,90.45 85.9,99.84 v1(86.66,99.84)
  Bottom Layer w0.254: 96.17,59.35 SW22.1 ; 96.17,59.35 82.96,59.35 81.94,58.33 81.94,50.71 SW29.1 94.64,34.97 94.64,16.93 SW36.1 ; 96.17,59.35 96.17,60.37 97.94,62.14 97.94,77.13 SW15.1 96.17,80.94 94.52,82.59 94.52,98.34 96.02,99.84 ; 96.02,99.84 SW8.1 ; 96.02,99.84 v1(86.66,99.84) 85.14,101.37 85.14,123.46 SW1.1
ROW2: length 167
  Top Layer w0.254: v1(102.15,88.92) 101.64,88.92 99.87,90.7 90.98,90.7 90.72,90.45 90.72,89.94 88.95,88.16 88.18,88.16 87.17,89.18 ROW_MUX1.8
  Bottom Layer w0.254: SW2.1 101.5,123.6 101.5,110.53 SW9.1 102.15,89.85 v1(102.15,88.92) SW16.1 110.64,77.38 110.64,59.35 SW23.1 110.77,56.17 110.77,38.14 SW30.1 110.64,34.71 110.64,17.06 SW37.1
ROW3: length 172.5
  Top Layer w0.254: v1(119.3,87.65) 65.32,87.65 ROW_MUX1.7
  Bottom Layer w0.254: SW38.1 129.82,16.8 129.82,34.84 SW31.1 126.65,38.01 126.65,56.17 SW24.1 126.39,59.48 126.39,77 SW17.1 v1(119.3,87.65) 119.3,90.61 SW10.1 126.65,101.51 126.65,118.53 SW3.1
ROW4: length 195.1
  Top Layer w0.254: v1(95.55,80.54) 140.25,80.54 141.78,79.02 142.79,79.02 ; v1(86.15,79.52) 85.14,80.54 84.63,80.54 78.53,86.64 ROW_MUX1.6 ; SW18.1 144.7,78.76 143.05,78.76 142.79,79.02 ; 142.79,79.02 142.79,80.54 v1(143.05,80.79)
  Bottom Layer w0.254: SW4.1 143.16,118.79 143.16,101.39 SW11.1 143.05,97.72 v1(143.05,80.79) ; SW39.1 143.41,16.8 143.41,34.58 SW32.1 143.41,38.14 143.41,55.79 SW25.1 143.3,59.46 v1(143.3,78.76) ; v1(86.15,79.52) 94.53,79.52 v1(95.55,80.54)
ROW5: length 212.8
  Top Layer w0.254: v1(159.56,75.5) 94.9,75.5 v1(92.76,77.64) ; v1(161.84,89.21) 161.84,92.01 v1(161.95,92.12) ; v1(82.85,77.38) 76.14,84.1 ROW_MUX1.4 ROW_MUX1.5
  Bottom Layer w0.254: 162.1,78.29 162.1,78.04 v1(159.56,75.5) 159.56,59.97 SW26.1 160.68,55.79 160.68,37.76 SW33.1 164.11,34.33 164.11,16.55 SW40.1 ; 162.1,78.29 SW19.1 ; 162.1,78.29 160.57,79.81 160.57,87.94 v1(161.84,89.21) ; v1(92.76,77.64) 92.25,77.13 83.1,77.13 v1(82.85,77.38) ; SW5.1 160.3,118.66 160.3,101.01 SW12.1 v1(161.95,92.12)
ROW6: length 233
  Top Layer w0.254: v1(178.59,75.61) SW20.1 176.3,76.11 96.17,76.11 v1(95.55,76.73) ; v1(82.09,77.24) 76.5,82.83 ROW_MUX1.3
  Bottom Layer w0.254: v1(95.55,76.73) 95.3,76.48 82.85,76.48 v1(82.09,77.24) ; SW41.1 180.37,16.8 180.37,34.46 SW34.1 176.81,38.01 176.81,55.67 SW27.1 180.37,59.22 180.37,73.83 v1(178.59,75.61) 180.37,77.38 180.37,97.58 SW13.1 180.49,101.26 180.49,118.53 SW6.1
ROW7: length 247.8
  Top Layer w0.254: v1(191.45,78.4) 188.4,81.45 95.44,81.45 v1(92.25,78.25) ; v1(86.15,78.25) 84.37,76.48 80.82,76.48 75.74,81.56 ROW_MUX1.2
  Bottom Layer w0.254: SW7.1 193.7,118.79 193.7,101.01 SW14.1 193.74,97.74 193.74,79.92 195.26,78.4 ; v1(191.45,78.4) 195.26,78.4 ; 195.26,78.4 SW21.1 193.96,76.88 193.96,59.09 SW28.1 194.08,55.92 194.08,37.89 SW35.1 193.96,34.46 193.96,16.8 SW42.1 ; v1(86.15,78.25) v1(92.25,78.25)
SCL: length 43.2
  Top Layer w0.254: 29.59,110.24 R69.2 R68.1 ; 29.59,110.24 28.83,110.24 27.31,111.76 24,111.76 19.18,116.59 19.18,117.35 20.7,118.87 20.7,132.08 20.45,132.33 ; 29.59,110.24 29.59,108.2 v1(29.34,107.95) ; 20.45,132.33 U1.19 ; 20.45,132.33 20.45,132.72 20.95,133.22 NOREF#2.TP19
  Bottom Layer w0.254: Screen1.3 29.34,105.03 v1(29.34,107.95)
SDA: length 54.5
  Top Layer w0.254: NOREF#8.TP20 23.24,132.59 U1.18 22.86,130.68 v1(29.46,124.08)
  Bottom Layer w0.254: 29.21,118.24 27.69,118.24 26.67,117.22 26.67,113.67 32,108.33 Screen1.4 ; 29.21,118.24 29.21,116.71 34.29,111.63 34.8,111.63 36.2,110.24 R68.2 ; 29.21,118.24 29.21,118.75 29.46,119 v1(29.46,124.08)
TPWR: length 34.8
  Top Layer w0.254: SW49.2 15.75,155.73 15.75,152.27 14.48,151 8.89,151 1.78,143.89 1.78,132.97 U1.VIN
VLED: length 253.9
  Top Layer w0.254: 78.5,44.08 72.53,44.08 ; 70.93,44.08 69.84,44.08 D57.1 ; 71.19,120.52 68.45,123.26 63.12,123.26 51.18,135.2 50.31,135.2 ; 48.44,135.91 46.61,137.74 ; v1(81.56,100.62) 85.11,104.18 85.11,107.48 D1.1 86.95,110.53 C2.1 77.91,115.44 C7.2 ; 38.62,137.74 25.98,150.37
  Top Layer w0.635: D57.1 69.82,42.97 70.93,44.08 71.04,44.19 72.43,44.19 73.65,42.97 77.38,42.97 v1(78.61,44.2) C59.1 ; U6.2 25.98,150.37 25.98,144.4 32.71,137.67 38,137.67 38.09,137.58 47,137.58 47.09,137.67 48.07,137.67 48.44,137.31 48.44,135.77 49.15,135.05 50.16,135.05 50.54,135.43 50.8,135.43 51.51,134.72 51.51,134.23 58.16,127.58 58.17,127.59 60.25,127.59 67.31,120.52 71.19,120.52 C7.2 v1(79.59,114.62) 81.22,114.62 C2.1 83.25,115.44 D1.1
  Bottom Layer w0.254: v1(81.56,100.62) 79.63,98.7 ; C59.1 v1(78.61,44.2)
  Bottom Layer w0.635: v1(79.59,114.62) 79.63,114.59 C59.1
VREF: length 196
  Top Layer w0.254: 108.97,141.73 109.47,142.24 109.47,144.02 NOREF#14.TP5 106.93,146.56 105.41,146.56 101.85,143 101.85,141.48 100.84,140.46 U21.3 ; 108.97,141.73 106.43,139.19 U21.5 105.93,138.94 v1(105.43,138.43) ; 108.97,141.73 108.97,141.22 111.51,138.68 138.76,138.68 NOREF#13.TP6 139.98,138.88 141.56,140.46 ; v1(55.9,131.32) 55.9,131.06 57.17,129.79 85.87,129.79 v1(86.63,130.56) ; U23.3 184.39,140.72 185.4,141.73 ; U23.5 189.21,139.45 186.93,141.73 185.4,141.73 ; 141.56,140.46 141.56,139.19 143.59,137.16 147.91,137.16 148.41,137.67 148.41,139.26 U22.5 156.35,139.45 158.38,141.48 174.64,141.48 177.18,144.02 184.9,144.02 185.4,143.51 185.4,141.73 ; 141.56,140.46 141.81,140.72 U22.3
  Bottom Layer w0.254: v1(105.43,138.43) 97.55,130.56 v1(86.63,130.56) ; 49.29,130.05 47.69,130.05 R46.2 ; 49.29,130.05 49.29,119.07 R47.2 ; 49.29,130.05 50.05,130.05 50.31,130.3 52.59,130.3 53.61,131.32 v1(55.9,131.32)
$1N66295: length 109.6
  Top Layer w0.254: D36.4 89.69,11.01 176.93,11.01 191.11,25.19 D35.2
$1N66297: length 21
  Top Layer w0.254: D15.2 92.81,67.1 105.26,67.1 105.51,67.35 105.51,72.53 D16.4
$1N66299: length 15.4
  Top Layer w0.635: D27.1 165.97,51.78 D26.3
$1N66303: length 15.3
  Top Layer w0.635: D29.3 99.8,30.95 D30.1
$1N66307: length 16.3
  Top Layer w0.635: D5.1 148.95,115.4 D4.3
$1N66319: length 14.8
  Top Layer w0.635: D24.1 115.42,52.16 D23.3
$1N66323: length 15.8
  Top Layer w0.635: D3.3 131.93,115.53 D4.1
$1N66327: length 21
  Top Layer w0.254: D23.4 105.51,51.32 105.51,46.14 105.26,45.89 92.81,45.89 D22.2
$1N66329: length 15.3
  Top Layer w0.635: D37.1 102.55,6.86 C36.1 99.23,9.74 D36.3
$1N66333: length 16
  Top Layer w0.635: D11.3 149.07,94.19 D12.1
$1N66337: length 16
  Top Layer w0.635: D32.1 132.31,30.82 D31.3
$1N66341: length 16.3
  Top Layer w0.635: D19.1 152.34,70.1 C33.1 149.01,73.24 D18.3
$1N66348: length 16.3
  Top Layer w0.254: v1(184.43,30.69) D35.4 ; D34.2 178.67,25.69 v1(182.73,29.76)
  Bottom Layer w0.254: v1(182.73,29.76) 183.49,29.76 v1(184.43,30.69)
$1N66350: length 16
  Top Layer w0.635: D11.1 131.93,94.58 D10.3
$1N66354: length 16.1
  Top Layer w0.635: D20.3 182.86,73.11 D21.1
$1N66358: length 15.9
  Top Layer w0.635: D39.1 132.18,9.61 D38.3
$1N66363: length 16
  Top Layer w0.635: D18.1 132.18,73.37 D17.3
$1N66367: length 247.9
  Top Layer w0.254: D7.3 189.08,116.67 122.79,116.67 121.26,115.15 121.26,109.56 118.21,106.51 111.36,106.51 100.94,96.1 88.24,96.1 87.73,95.59 87.73,90.39
  Top Layer w0.635: D8.1 87.73,90.39 87.43,90.68 87.43,107.76 87.88,108.2 183.66,108.2 184.38,108.93 188.3,108.93 188.57,109.2 188.57,113.12 D7.3
$1N66371: length 15.1
  Top Layer w0.635: D9.3 115.55,94.58 D10.1
$1N66375: length 21.9
  Top Layer w0.254: D14.4 186.51,95.29 172.95,95.29 172.7,95.04 172.7,90.21 D13.2
$1N66377: length 16.1
  Top Layer w0.635: D33.1 149.33,30.69 D32.3
$1N66381: length 15.2
  Top Layer w0.635: D15.3 99.67,73.37 D16.1
$1N66385: length 15.8
  Top Layer w0.635: D5.3 165.97,115.15 D6.1
$1N66389: length 21.2
  Top Layer w0.254: D20.4 169.87,74.08 156.69,74.08 156.44,73.83 156.44,69 D19.2
$1N66391: length 21.9
  Top Layer w0.254: D21.4 186.76,74.21 173.08,74.21 172.82,73.95 172.82,69.13 D20.2
$1N66393: length 252
  Top Layer w0.254: 87.4,5.75 87.4,10.37 88.67,11.64 101.45,11.64 111.68,21.88 118.29,21.88 121.52,25.11 121.52,30.44 123.04,31.96 189.84,31.96 D35.3
  Top Layer w0.635: D36.1 85.4,7.75 85.4,14.46 85.51,14.57 85.51,20.99 85.4,21.1 85.4,23.55 85.85,24 184.42,24 184.89,24.47 188.81,24.47 189.08,24.75 189.08,28.66 D35.3
$1N66399: length 16.1
  Top Layer w0.635: D25.1 135.57,48.9 C34.1 131.61,52.16 D24.3
$1N66403: length 109.1
  Top Layer w0.254: D22.4 89.77,53.38 101.7,53.38 107.8,59.48 182.48,59.48 190.86,67.86 D21.2
$1N66405: length 16
  Top Layer w0.254: v1(150.85,30.52) 154.41,30.52 D33.4 ; v1(149.33,29.5) 145.52,25.69 D32.2
  Bottom Layer w0.254: v1(150.85,30.52) 149.84,29.5 v1(149.33,29.5)
$1N66411: length 21.3
  Top Layer w0.254: D12.2 158.22,88.05 171.43,88.05 171.68,88.31 171.68,93.23 D13.4
$1N66413: length 19.8
  Top Layer w0.254: D7.1 185.36,112.4 C31.1
  Top Layer w0.635: D6.3 181.65,115.15 C31.1 186.65,110.15 D7.1
$1N66418: length 109.9
  Top Layer w0.254: D15.4 88.54,75.4 95.1,81.96 146.03,81.96 149.07,85 186.67,85 D14.2
